# EAGLE design BAAAHS-BRN01-C (EAGLE 9.4.1)

## Sheet 1 of 2
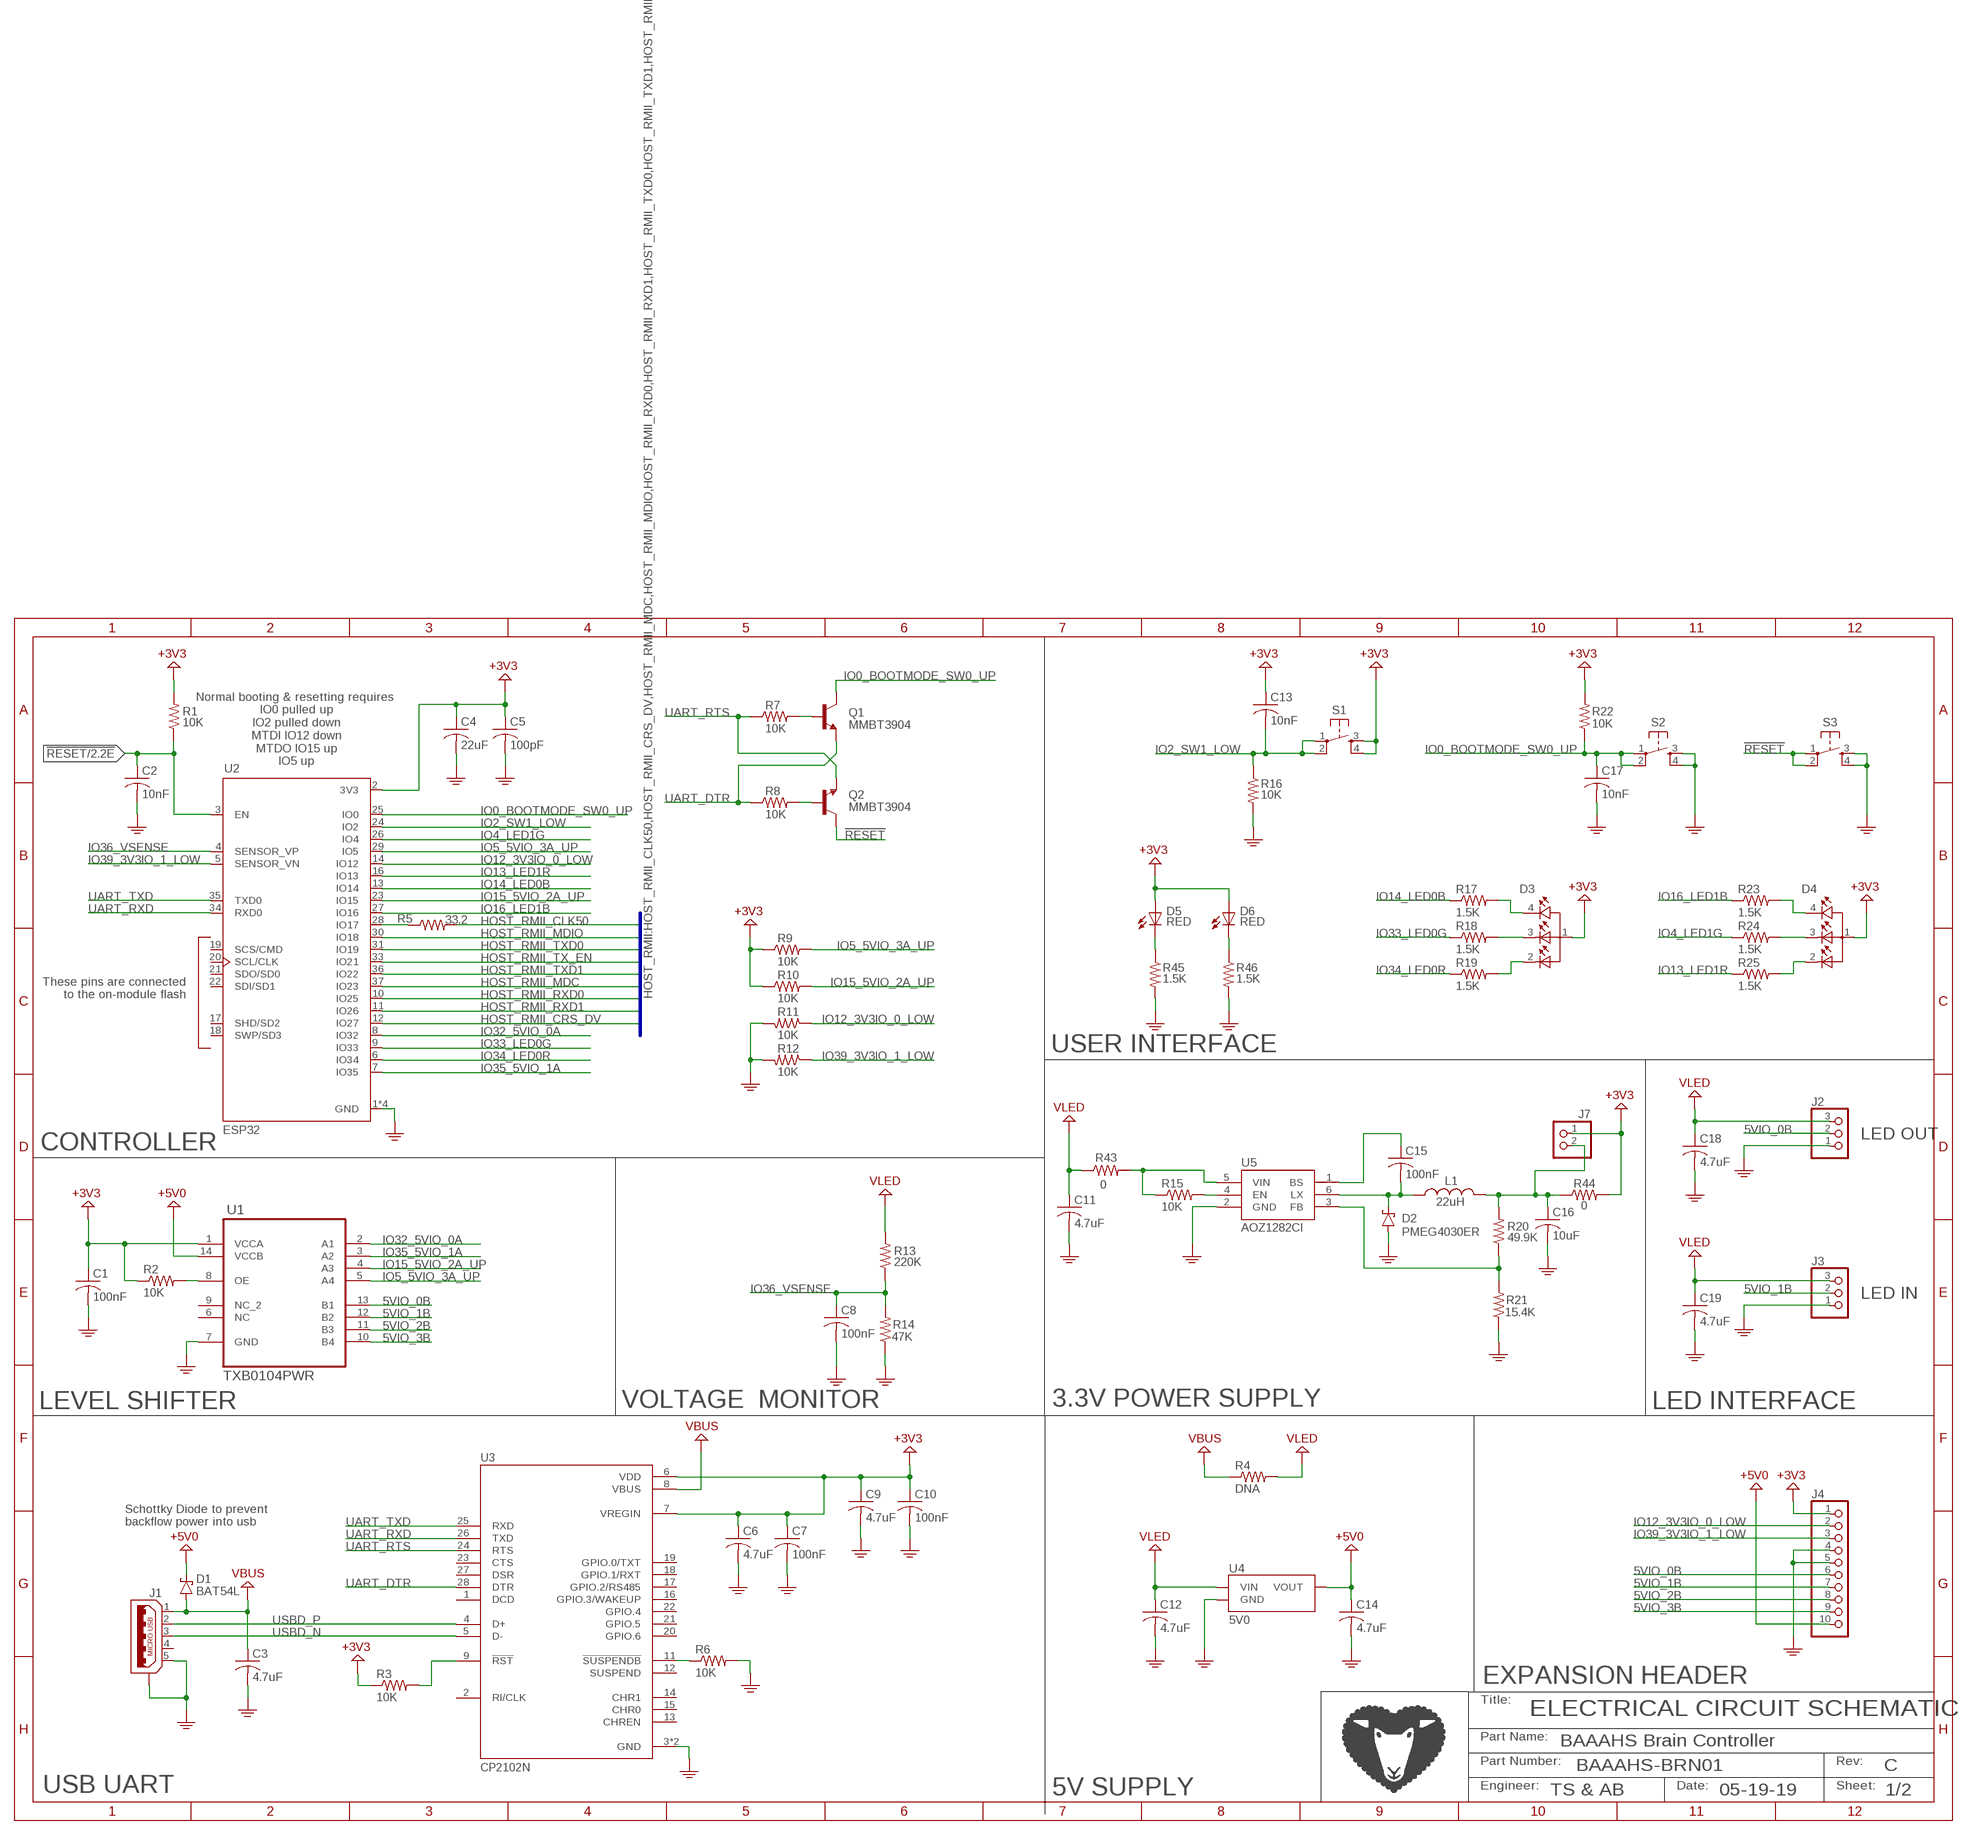
[diagram p0: schematic, sheet 1]
U$1 (SCHEMATIC_TITLEBLOCK_BAAAHS_11X17): DATE: 05-19-19; ENGINEER: TS & AB; PART_NAME: BAAAHS Brain Controller; PART_NUMBER: BAAAHS-BRN01; REV: C

### Parts
C1  100nF  C-100NF_25V_10%-C0402  [C0402]
C2  10nF  C-10NF_16V_10%-C0402  [C0402]
C3  4.7uF  C-4.7UF_10V_10%-C0402  [C0402]
C4  22uF  C-22UF_10V_20%-C0603  [C0603]
C5  100pF  C-100PF_50V_5%-C0402  [C0402]
C6  4.7uF  C-4.7UF_10V_10%-C0402  [C0402]
C7  100nF  C-100NF_25V_10%-C0402  [C0402]
C8  100nF  C-100NF_25V_10%-C0402  [C0402]
C9  4.7uF  C-4.7UF_10V_10%-C0402  [C0402]
C10  100nF  C-100NF_25V_10%-C0402  [C0402]
C11  4.7uF  C-4.7UF_25V_10%-C0603  [C0603]
C12  4.7uF  C-4.7UF_25V_10%-C0603  [C0603]
C13  10nF  C-10NF_16V_10%-C0402  [C0402]
C14  4.7uF  C-4.7UF_10V_10%-C0402  [C0402]
C15  100nF  C-100NF_25V_10%-C0402  [C0402]
C16  10uF  C-10UF_25V_20%-C0603  [C0603]
C17  10nF  C-10NF_16V_10%-C0402  [C0402]
C18  4.7uF  C-4.7UF_25V_10%-C0603  [C0603]
C19  4.7uF  C-4.7UF_25V_10%-C0603  [C0603]
D1  BAT54L  D_SCHOTTKY-SOT23  [SOT23]
D2  PMEG4030ER  D_SCHOTTKY-PMEG4030ER_40V-SOD123  [SOD123]
D3  APTF1616LSEEZGKQBKC  [LEDSC160X160X070-4N]
D4  APTF1616LSEEZGKQBKC  [LEDSC160X160X070-4N]
D5  RED  LED-RED_54MCD-D0603  [D0603]
D6  RED  LED-RED_54MCD-D0603  [D0603]
J1  USB_MICRO-FCI-USB_MICRO_A_RA  [USB_MICRO_A_RA]
J2  PINHD1X3-20AWG  [3WAY_LED_WIRES]
J3  PINHD1X3-20AWG  [3WAY_LED_WIRES]
J4  PINHD1X10-1X10  [1X10]
J7  PINHD1X2-1X02  [1X02]
L1  22uH  L-22UH__290MOHM_700MA-NRG4026  [NRG4026]
Q1  MMBT3904  NPN-MMBT3904_40V-SOT23  [SOT23]
Q2  MMBT3904  NPN-MMBT3904_40V-SOT23  [SOT23]
R1  10K  R-10K_1%-R0402  [R0402]
R2  10K  R-10K_1%-R0402  [R0402]
R3  10K  R-10K_1%-R0402  [R0402]
R4  DNA  R-DNA-R0603  [R0603]
R5  33.2  R-33.2_1%-R0402  [R0402]
R6  10K  R-10K_1%-R0402  [R0402]
R7  10K  R-10K_1%-R0402  [R0402]
R8  10K  R-10K_1%-R0402  [R0402]
R9  10K  R-10K_1%-R0402  [R0402]
R10  10K  R-10K_1%-R0402  [R0402]
R11  10K  R-10K_1%-R0402  [R0402]
R12  10K  R-10K_1%-R0402  [R0402]
R13  220K  R-220K_1%-R0402  [R0402]
R14  47K  R-47K_1%-R0402  [R0402]
R15  10K  R-10K_1%-R0402  [R0402]
R16  10K  R-10K_1%-R0402  [R0402]
R17  1.5K  R-1.5K_1%-R0402  [R0402]
R18  1.5K  R-1.5K_1%-R0402  [R0402]
R19  1.5K  R-1.5K_1%-R0402  [R0402]
R20  49.9K  R-49.9K_1%-R0402  [R0402]
R21  15.4K  R-15.4K_1%-R0402  [R0402]
R22  10K  R-10K_1%-R0402  [R0402]
R23  1.5K  R-1.5K_1%-R0402  [R0402]
R24  1.5K  R-1.5K_1%-R0402  [R0402]
R25  1.5K  R-1.5K_1%-R0402  [R0402]
R43  0  R-0_1%-R0603  [R0603]
R44  0  R-0_1%-R0603  [R0603]
R45  1.5K  R-1.5K_1%-R0402  [R0402]
R46  1.5K  R-1.5K_1%-R0402  [R0402]
S1  SW4-SM6MM  [SM6MM]
S2  SW4-SM6MM  [SM6MM]
S3  SW4-SM6MM  [SM6MM]
U1  TXB0104PWR  [SOP65P640X120-14N]
U2  ESP32  ESP32WROOM32D-MODULE_ESP32WROOM32D  [MODULE_ESP32WROOM32D]
U3  CP2102N  CP2102N-A01-GQFN28  [QFN50P500X500X80_29N]
U4  5V0  TLV76050DBZR-SOT23  [SOT23]
U5  AOZ1282CI  AOZ1282CI-SOT23_6  [SOT23_6]

### Nets
3V3: C1.1 C4.1 C5.1 C6.1 C7.1 C9.1 C10.1 C13.1 D3.1 D4.1 D5.A D6.A J4.1 J7.1 R1.2 R2.1 R3.1 R9.1 R10.1 R22.2 R44.2 S1.3(S) S1.4(S1) U1.1(VCCA) U2.2(3V3) U3.6(VDD) U3.7(VREGIN) ; also sheet 2
5V0 [power]: C14.1 D1.3(C) J4.10 U1.14(VCCB) U4.1(VOUT)
5VIO_0B: J2.2 J4.6 U1.13(B1)
5VIO_1B: J3.2 J4.7 U1.12(B2)
5VIO_2B: J4.8 U1.11(B3)
5VIO_3B: J4.9 U1.10(B4)
!RESET: C2.1 Q2.3(C) R1.1 S3.1(P) S3.2(P1) U2.3(EN) ; also sheet 2
FB: R20.1 R21.2 U5.3(FB)
GND: C1.2 C2.2 C3.2 C4.2 C5.2 C6.2 C7.2 C8.2 C9.2 C10.2 C11.2 C12.2 C14.2 C16.2 C17.2 C18.2 C19.2 D2.A J1.5 J1.S1 J1.S2(S1) J1.S3(S1) J1.S4(S1) J1.S5(S1) J1.S6(S1) J2.1 J3.1 J4.4 J4.5 R6.2 R11.2 R12.2 R14.1 R16.2 R21.1 R45.2 R46.2 S2.3(S) S2.4(S1) S3.3(S) S3.4(S1) U1.7(GND) U2.1(GND) U2.15(GND) U2.38(GND) U2.39(GND) U3.3(GND) U3.29(GND) U4.3(GND) U5.2(GND) ; also sheet 2
HOST_RMII_CLK50: R5.2 ; also sheet 2
HOST_RMII_CRS_DV: U2.12(IO27) ; also sheet 2
HOST_RMII_MDC: U2.37(IO23) ; also sheet 2
HOST_RMII_MDIO: U2.30(IO18) ; also sheet 2
HOST_RMII_RXD0: U2.10(IO25) ; also sheet 2
HOST_RMII_RXD1: U2.11(IO26) ; also sheet 2
HOST_RMII_TX_EN: U2.33(IO21) ; also sheet 2
HOST_RMII_TXD0: U2.31(IO19) ; also sheet 2
HOST_RMII_TXD1: U2.36(IO22) ; also sheet 2
IO0_BOOTMODE_SW0_UP: C17.1 Q1.3(C) R22.1 S2.1(P) S2.2(P1) U2.25(IO0)
IO2_SW1_LOW: C13.2 R16.1 S1.1(P) S1.2(P1) U2.24(IO2)
IO4_LED1G: R24.1 U2.26(IO4)
IO5_5VIO_3A_UP: R9.2 U1.5(A4) U2.29(IO5)
IO12_3V3IO_0_LOW: J4.2 R11.1 U2.14(IO12)
IO13_LED1R: R25.1 U2.16(IO13)
IO14_LED0B: R17.1 U2.13(IO14)
IO15_5VIO_2A_UP: R10.2 U1.4(A3) U2.23(IO15)
IO16_LED1B: R23.1 U2.27(IO16)
IO32_5VIO_0A: U1.2(A1) U2.8(IO32)
IO33_LED0G: R18.1 U2.9(IO33)
IO34_LED0R: R19.1 U2.6(IO34)
IO35_5VIO_1A: U1.3(A2) U2.7(IO35)
IO36_VSENSE: C8.1 R13.1 R14.2 U2.4(SENSOR_VP)
IO39_3V3IO_1_LOW: J4.3 R12.1 U2.5(SENSOR_VN)
N$1: R5.1 U2.28(IO17)
N$3: R15.2 U5.4(EN)
N$4: C15.2 D2.C L1.1 U5.6(LX)
N$5: R3.2 U3.9(!RST)
N$6: R6.1 U3.11(!SUSPENDB)
N$7: Q2.1(B) R8.2
N$8: Q1.1(B) R7.2
N$9: D3.4 R17.2
N$10: D3.3 R18.2
N$11: D3.2 R19.2
N$14: D4.4 R23.2
N$15: D4.3 R24.2
N$16: D4.2 R25.2
N$26: C15.1 U5.1(BS)
N$27: R2.2 U1.8(OE)
N$30 [power]: R15.1 R43.2 U5.5(VIN)
N$31: C16.1 J7.2 L1.2 R20.2 R44.1
N$33: D6.C R46.1
N$36: D5.C R45.1
UART_DTR: Q1.2(E) R8.1 U3.28(DTR)
UART_RTS: Q2.2(E) R7.1 U3.24(RTS)
UART_RXD: U2.34(RXD0) U3.26(TXD)
UART_TXD: U2.35(TXD0) U3.25(RXD)
USBD_N [USB]: J1.3 U3.5(D-)
USBD_P [USB]: J1.2 U3.4(D+)
VBUS: C3.1 D1.1(A) J1.1 R4.1 U3.8(VBUS)
VLED [power]: C11.1 C12.1 C18.1 C19.1 J2.3 J3.3 R4.2 R13.2 R43.1 U4.2(VIN)
Unconnected: J1.4 U1.6(NC) U1.9(NC_2) U2.17(SHD/SD2) U2.18(SWP/SD3) U2.19(SCS/CMD) U2.20(SCL/CLK) U2.21(SDO/SD0) U2.22(SDI/SD1) U3.1(DCD) U3.2(RI/CLK) U3.12(SUSPEND) U3.13(CHREN) U3.14(CHR1) U3.15(CHR0) U3.16(GPIO.3/WAKEUP) U3.17(GPIO.2/RS485) U3.18(GPIO.1/RXT) U3.19(GPIO.0/TXT) U3.20(GPIO.6) U3.21(GPIO.5) U3.22(GPIO.4) U3.23(CTS) U3.27(DSR)

### Buses
HOST_RMII:HOST_RMII_CLK50,HOST_RMII_CRS_DV,HOST_RMII_MDC,HOST_RMII_MDIO,HOST_RMII_RXD0,HOST_RMII_RXD1,HOST_RMII_TXD0,HOST_RMII_TXD1,HOST_RMII_TX_EN

### Notes on the sheet
- Normal booting & resetting requires 
  IO0 pulled up
  IO2 pulled down
  MTDI IO12 down
  MTDO IO15 up
  IO5 up
- These pins are connected
  to the on-module flash
- USER INTERFACE
- LED OUT
- CONTROLLER
- LED IN
- LEVEL SHIFTER | VOLTAGE  MONITOR | 3.3V POWER SUPPLY | LED INTERFACE
- Schottky Diode to prevent
  backflow power into usb
- EXPANSION HEADER
- USB UART | 5V SUPPLY

## Sheet 2 of 2
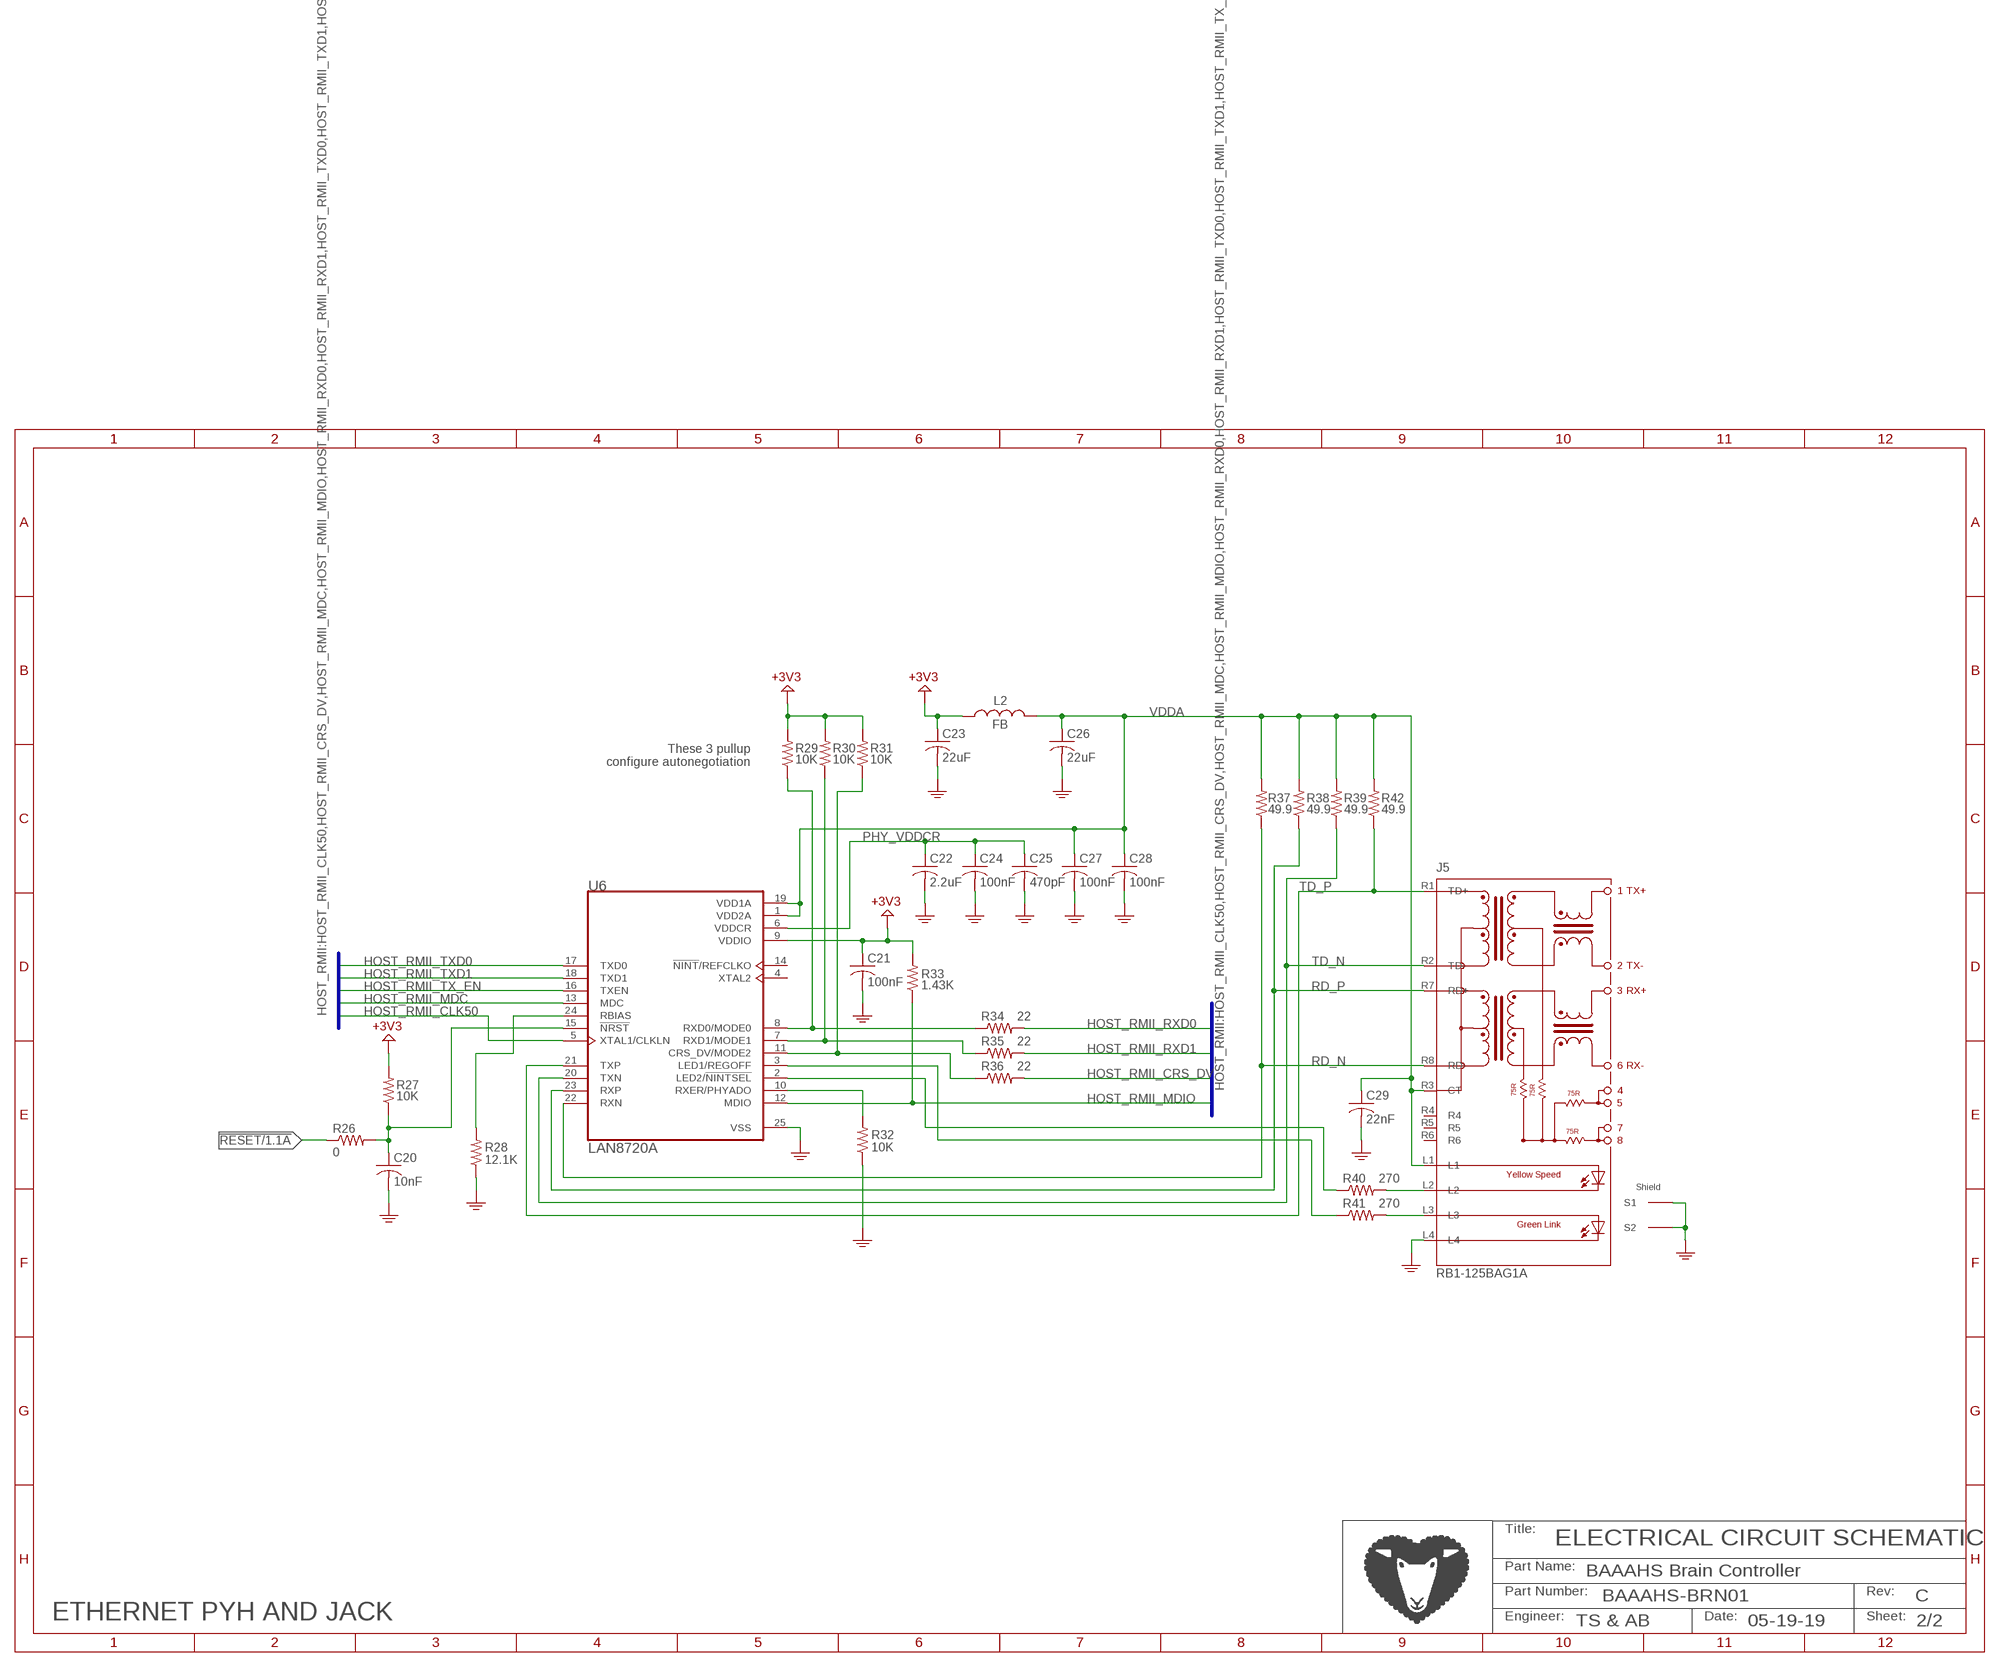
[diagram p1: schematic, sheet 2]
U$2 (SCHEMATIC_TITLEBLOCK_BAAAHS_11X17): DATE: 05-19-19; ENGINEER: TS & AB; PART_NAME: BAAAHS Brain Controller; PART_NUMBER: BAAAHS-BRN01; REV: C

### Parts
C20  10nF  C-10NF_16V_10%-C0402  [C0402]
C21  100nF  C-100NF_25V_10%-C0402  [C0402]
C22  2.2uF  C-2.2UF_16V_10%-C0603  [C0603]
C23  22uF  C-22UF_10V_20%-C0603  [C0603]
C24  100nF  C-100NF_25V_10%-C0402  [C0402]
C25  470pF  C-470PF_50V_10%-C0402  [C0402]
C26  22uF  C-22UF_10V_20%-C0603  [C0603]
C27  100nF  C-100NF_25V_10%-C0402  [C0402]
C28  100nF  C-100NF_25V_10%-C0402  [C0402]
C29  22nF  C-22NF_16V_10%-C0402  [C0402]
J5  RB1-125BAG1A  [WIZNET_RB1-125BAG1A]
L2  FB  FB-600OHM_0.2A-L0603  [L0603]
R26  0  R-0_1%-R0402  [R0402]
R27  10K  R-10K_1%-R0402  [R0402]
R28  12.1K  R-12.1K_1%-R0402  [R0402]
R29  10K  R-10K_1%-R0402  [R0402]
R30  10K  R-10K_1%-R0402  [R0402]
R31  10K  R-10K_1%-R0402  [R0402]
R32  10K  R-10K_1%-R0402  [R0402]
R33  1.43K  R-1.43K_1%-R0402  [R0402]
R34  22  R-22_1%-R0402  [R0402]
R35  22  R-22_1%-R0402  [R0402]
R36  22  R-22_1%-R0402  [R0402]
R37  49.9  R-49.9_1%-R0402  [R0402]
R38  49.9  R-49.9_1%-R0402  [R0402]
R39  49.9  R-49.9_1%-R0402  [R0402]
R40  270  R-270_1%-R0402  [R0402]
R41  270  R-270_1%-R0402  [R0402]
R42  49.9  R-49.9_1%-R0402  [R0402]
U6  LAN8720A  LAN8720A-CP  [QFN50P400X400X100-25N]

### Nets
3V3: C21.1 C23.1 L2.1 R27.2 R29.2 R30.2 R31.2 R33.2 U6.9(VDDIO) ; also sheet 1
!RESET: R26.1 ; also sheet 1
GND: C20.2 C21.2 C22.2 C23.2 C24.2 C25.2 C26.2 C27.2 C28.2 C29.2 J5.L4 J5.S1 J5.S2 R28.1 R32.1 U6.25(VSS) ; also sheet 1
HOST_RMII_CLK50: U6.5(XTAL1/CLKLN) ; also sheet 1
HOST_RMII_CRS_DV: R36.2 ; also sheet 1
HOST_RMII_MDC: U6.13(MDC) ; also sheet 1
HOST_RMII_MDIO: R33.1 U6.12(MDIO) ; also sheet 1
HOST_RMII_RXD0: R34.2 ; also sheet 1
HOST_RMII_RXD1: R35.2 ; also sheet 1
HOST_RMII_TX_EN: U6.16(TXEN) ; also sheet 1
HOST_RMII_TXD0: U6.17(TXD0) ; also sheet 1
HOST_RMII_TXD1: U6.18(TXD1) ; also sheet 1
N$2: J5.L3 R41.2
N$18: R31.1 R36.1 U6.11(CRS_DV/MODE2)
N$20: R30.1 R35.1 U6.7(RXD1/MODE1)
N$21: R29.1 R34.1 U6.8(RXD0/MODE0)
N$22: R28.2 U6.24(RBIAS)
N$23: R41.1 U6.3(LED1/REGOFF)
N$24: R40.1 U6.2(LED2/!NINTSEL!)
N$25: J5.L2 R40.2
N$28: C20.1 R26.2 R27.1 U6.15(!NRST)
N$29: R32.2 U6.10(RXER/PHYADO)
PHY_VDDCR: C22.1 C24.1 C25.1 U6.6(VDDCR)
RD_N [Ethernet]: J5.R8(RD-) R37.1 U6.22(RXN)
RD_P [Ethernet]: J5.R7(RD+) R38.1 U6.23(RXP)
TD_N [Ethernet]: J5.R2(TD-) R39.1 U6.20(TXN)
TD_P [Ethernet]: J5.R1(TD+) R42.1 U6.21(TXP)
VDDA: C26.1 C27.1 C28.1 C29.1 J5.L1 J5.R3(CT) L2.2 R37.2 R38.2 R39.2 R42.2 U6.1(VDD2A) U6.19(VDD1A)
Unconnected: J5.R4 J5.R5 J5.R6 U6.4(XTAL2) U6.14(!NINT!/REFCLKO)

### Buses
HOST_RMII:HOST_RMII_CLK50,HOST_RMII_CRS_DV,HOST_RMII_MDC,HOST_RMII_MDIO,HOST_RMII_RXD0,HOST_RMII_RXD1,HOST_RMII_TXD0,HOST_RMII_TXD1,HOST_RMII_TX_EN

### Notes on the sheet
- These 3 pullup
  configure autonegotiation
- ETHERNET PYH AND JACK

## Library data of the parts
C1 C7 C8 C10 C15 C21 C24 C27 C28 = capacitors:C; CAPACITANCE: 100nF; CAPACITANCE_TOLERANCE: 10%; CATEGORY: Capacitor; DESCRIPTION: CAP CER 100NF 25V X7R 0402; DIELECTRIC: X7R; FOOTPRINT: C0402; HEIGHT: 0.55mm; LENGTH: 1.0mm; OPL: YES; PACKAGE: C0402; PRI_MFG: Samsung; PRI_MFG_PN: CL05B104KA5NNNC; THICKNESS: 0.55mm; TOLERANCE: +/-10%; VOLTAGE: 25V; WIDTH: 0.5mm
C2 C13 C17 C20 = capacitors:C; CAPACITANCE: 10nF; CAPACITANCE_TOLERANCE: 10%; CATEGORY: Capacitor; DESCRIPTION: CAP CER 10NF 16V X7R 0402; DIELECTRIC: X7R; FOOTPRINT: C0402; HEIGHT: 0.55mm; LENGTH: 1.0mm; OPL: YES; PACKAGE: C0402; PRI_MFG: Samsung; PRI_MFG_PN: CL05B103KO5NNNC; THICKNESS: 0.55mm; TOLERANCE: +/-10%; VOLTAGE: 16V; WIDTH: 0.5mm
C3 C6 C9 C14 = capacitors:C; CAPACITANCE: 4.7uF; CAPACITANCE_TOLERANCE: 10%; CATEGORY: Capacitor; DESCRIPTION: CAP CER 4.7UF 10V X5R 0402; DIELECTRIC: X5R; FOOTPRINT: C0402; HEIGHT: 0.55mm; LENGTH: 1.0mm; OPL: YES; PACKAGE: C0402; PRI_MFG: Samsung; PRI_MFG_PN: CL05A475KP5NRNC; THICKNESS: 0.55mm; TOLERANCE: +/-10%; VOLTAGE: 10V; WIDTH: 0.5mm
C4 C23 C26 = capacitors:C; CAPACITANCE: 22uF; CAPACITANCE_TOLERANCE: 20%; CATEGORY: Capacitor; DESCRIPTION: CAP CER 22UF 10V X5R 0603; DIELECTRIC: X5R; FOOTPRINT: C0603; HEIGHT: 1.0mm; LENGTH: 1.6mm; OPL: YES; PACKAGE: C0603; PRI_MFG: Samsung; PRI_MFG_PN: CL10A226MP8NUNE; THICKNESS: 1.0mm; TOLERANCE: +/-20%; VOLTAGE: 10V; WIDTH: 0.8mm
C5 = capacitors:C; CAPACITANCE: 100pF; CAPACITANCE_TOLERANCE: 5%; CATEGORY: Capacitor; DESCRIPTION: CAP CER 100PF 50V C0G 0402; DIELECTRIC: C0G; FOOTPRINT: C0402; HEIGHT: 0.55mm; LENGTH: 1.0mm; OPL: YES; PACKAGE: C0402; PRI_MFG: Samsung; PRI_MFG_PN: CL05C101JB5NNNC; THICKNESS: 0.55mm; TOLERANCE: +/-5%; VOLTAGE: 50V; WIDTH: 0.5mm
C11 C12 C18 C19 = capacitors:C; CAPACITANCE: 4.7uF; CAPACITANCE_TOLERANCE: 10%; CATEGORY: Capacitor; DESCRIPTION: CAP CER 4.7UF 25V X5R 0603; DIELECTRIC: X5R; FOOTPRINT: C0603; HEIGHT: 1.0mm; LENGTH: 1.6mm; OPL: YES; PACKAGE: C0603; PRI_MFG: Samsung; PRI_MFG_PN: CL10A475KA8NQNC; THICKNESS: 1.0mm; TOLERANCE: +/-10%; VOLTAGE: 25V; WIDTH: 0.8mm
C16 = capacitors:C; CAPACITANCE: 10uF; CAPACITANCE_TOLERANCE: 20%; CATEGORY: Capacitor; DESCRIPTION: CAP CER 10UF 25V X5R 0603; DIELECTRIC: X5R; FOOTPRINT: C0603; HEIGHT: 1.0mm; LENGTH: 1.6mm; OPL: YES; PACKAGE: C0603; PRI_MFG: Samsung; PRI_MFG_PN: CL10A106MA8NRNC; THICKNESS: 1.0mm; TOLERANCE: +/-20%; VOLTAGE: 25V; WIDTH: 0.8mm
C22 = capacitors:C; CAPACITANCE: 2.2uF; CAPACITANCE_TOLERANCE: 10%; CATEGORY: Capacitor; DESCRIPTION: CAP CER 2.2UF 16V X5R 0603; DIELECTRIC: X5R; FOOTPRINT: C0603; HEIGHT: 1.0mm; LENGTH: 1.6mm; OPL: YES; PACKAGE: C0603; PRI_MFG: Samsung; PRI_MFG_PN: CL10A225KO8NNNC; THICKNESS: 1.0mm; TOLERANCE: +/-10%; VOLTAGE: 16V; WIDTH: 0.8mm
C25 = capacitors:C; CAPACITANCE: 470pF; CAPACITANCE_TOLERANCE: 10%; CATEGORY: Capacitor; DESCRIPTION: CAP CER 470PF 50V X7R 0402; DIELECTRIC: X7R; FOOTPRINT: C0402; HEIGHT: 0.55mm; LENGTH: 1.0mm; OPL: YES; PACKAGE: C0402; PRI_MFG: Samsung; PRI_MFG_PN: CL05B471KB5NNNC; THICKNESS: 0.55mm; TOLERANCE: +/-10%; VOLTAGE: 50V; WIDTH: 0.5mm
C29 = capacitors:C; CAPACITANCE: 22nF; CAPACITANCE_TOLERANCE: 10%; CATEGORY: Capacitor; DESCRIPTION: CAP CER 22NF 16V X7R 0402; DIELECTRIC: X7R; FOOTPRINT: C0402; HEIGHT: 0.55mm; LENGTH: 1.0mm; OPL: YES; PACKAGE: C0402; PRI_MFG: Samsung; PRI_MFG_PN: CL05B223KO5NNNC; THICKNESS: 0.55mm; TOLERANCE: +/-10%; VOLTAGE: 16V; WIDTH: 0.5mm
D1 = diodes:D_SCHOTTKY; CAPACITANCE: 10pF; CATEGORY: Diode & Rectifier; CURRENT: 200mA; DESCRIPTION: DIODE SCHOTTKY 30V 200MA SOT23-3; DIGIKEY_PN: BAT54LT1GOSCT-ND; FORWARD_VOLTAGE: 800mV; HEIGHT: 1.0mm; LAST_SYNC: 2017/01/06; OPL: YES; OPL_PN: BAT54LT1G; PACKAGE: SOT23; PRICE_1K: 0.010; PRI_MFG: Fairchild Semiconductor; PRI_MFG_PN: BAT54LT1G; REVERSE_VOLTAGE: 30V
D2 = diodes:D_SCHOTTKY; CATEGORY: Diode & Rectifier; CURRENT: 3A; DESCRIPTION: DIODE SCHOTTKY 40V 3A SOD123W; DIGIKEY_PN: 1727-5313-1-ND; FORWARD_VOLTAGE: 460mV; HEIGHT: 1.1mm; IF: 3A; LENGTH: 3.3mm; OPL: YES; PACKAGE: SOD123; PRI_MFG: Nexperia USA Inc.; PRI_MFG_PN: PMEG4030ER,115; REVERSE_VOLTAGE: 40V; WIDTH: 1.9mm
D3 D4 = leds:APTF1616LSEEZGKQBKC: HELI Colour; 1.6X1.6MM LOW CURRENT RGB SMD LED; DESCRIPTION: LED RGB CLEAR 4SMD; DIGIKEY_PN: 754-1972-2-ND; PACKAGE: 0606; PRI_MFG: Kingbright; PRI_MFG_PN: APTF1616LSEEZGKQBKC
D5 D6 = leds:LED; ANGLE: 130deg; CATEGORY: Optoelectronics; COLOR: Red; CURRENT: 20mA; DESCRIPTION: LED RED CLEAR 0603 SMD; DIGIKEY_PN: 160-1447-1-ND; FORWARD_VOLTAGE: 2V; HEIGHT: 0.55mm; LAST_SYNC: 2016/10/21; LENGTH: 1.6mm; LUMINOUS_INTENSITY: 54mcd; OPL: YES; OPL_PN: ORH-R36G; PACKAGE: D0603; PRICE_1K: 0.027; PRI_MFG: Lite-On; PRI_MFG_PN: LTST-C191KRKT; VIEWING_ANGLE: 130; WAVELENGTH: 639nm; WIDTH: 0.8mm
J1 = connectors:USB_MICRO; CATEGORY: Header, Socket & Connector; DESCRIPTION: CONN RCPT USB2.0 MICRO B SMD R/A; DIGIKEY_PN: 609-4616-1-ND; OPL: YES; PACKAGE: USB_MICRO_A_RA; PRICE_1K: 0.20843; PRI_MFG: FCI; PRI_MFG_PN: 10118193-0001LF
J2 J3 = connectors:PINHD1X3: PIN HEADER
J4 = connectors:PINHD1X10
J5 = connectors:RB1-125BAG1A: Wiznet RB1-125BAG1A RJ45 1x1 Tab Down Through Hole; DESCRIPTION: CONN MAGJACK 1PORT 100 BASE-T; DIGIKEY_PN: 1278-1011-ND; PRI_MFG: WIZnet; PRI_MFG_PN: RB1-125BAG1A
J7 = connectors:PINHD1X2
L1 = inductors:L: General purpose power inductors; CATEGORY: Inductor, Coil & Filter; DESCRIPTION: FIXED IND 22UH 700MA 290 MOHM; DIGIKEY_PN: 732-5510-1-ND; HEIGHT: 1.8mm; INDUCTANCE: 22uH; OPL: YES; OPL_MFG: Sunlord; OPL_PN: SWPA4020S220MT; PRI_MFG: Wurth Electronics Inc.; PRI_MFG_PN: 74404042220; WIDTH: 4.0mm
L2 = inductors:FB: General purpose ferrite bead filter elements; CATEGORY: Inductor, Coil & Filter; CURRENT: 200mA; DCR: 600mOhm; DESCRIPTION: FERRITE BEAD 600 OHM 0603 1LN; DIGIKEY_PN: 490-5227-1-ND; HEIGHT: 0.95mm; OPL: YES; PACKAGE: L0603; PRICE_1K: 0.02640; PRI_MFG: Murata; PRI_MFG_PN: BLM18RK601SN1D; R_100MHZ: 600Ohm
Q1 Q2 = transistors:NPN: General Purpose Bipolar NPN Transistors; CATEGORY: Transistor, Mosfet & SCR; CURRENT: 200mA; DESCRIPTION: TRANS NPN 40V 0.2A SOT23; DIGIKEY_PN: MMBT3904LT3GOSCT-ND; HEIGHT: 1.0; LAST_SYNC: 2017/02/09; OPL: YES; PACKAGE: SOT23; PRICE_1K: 0.150; PRI_MFG: ON Semiconductor; PRI_MFG_PN: MMBT3904LT3G; VOLTAGE: 40V; VOLTAGE_RATING_DC: 40V; VSAT: 0.3V
R1-R3 R6-R12 R15 R16 R22 R27 R29-R32 = resistors:R; CATEGORY: Resistor & Potentiometer; DESCRIPTION: RES SMD 10K 1% 1/16W 0402; FOOTPRINT: R0402; HEIGHT: 0.4mm; LENGTH: 1.0mm; OPL: YES; PACKAGE: R0402; POWER: 1/16W; PRICE_1K: 0.01; PRI_MFG: Yageo; PRI_MFG_PN: RC0402FR-0710KL; P_MAX: 1/16W; RESISTANCE: 10Kohm; THICKNESS: 0.4mm; TOLERANCE: 1%; WIDTH: 0.5mm
R4 = resistors:R; CATEGORY: Resistor & Potentiometer; DIGIKEY_PN: N/A; HEIGHT: 0.45mm; LENGTH: 1.6mm; PACKAGE: R0603; POWER: 1/16W; PRI_MFG: N/A; PRI_MFG_PN: N/A; TOLERANCE: N/A; WIDTH: 0.8mm
R5 = resistors:R; CATEGORY: Resistor & Potentiometer; DESCRIPTION: RES SMD 33.2 1% 1/16W 0402; FOOTPRINT: R0402; HEIGHT: 0.4mm; LENGTH: 1.0mm; OPL: YES; PACKAGE: R0402; POWER: 1/16W; PRICE_1K: 0.01; PRI_MFG: Yageo; PRI_MFG_PN: RC0402FR-0733R2L; P_MAX: 1/16W; RESISTANCE: 33.2ohm; THICKNESS: 0.4mm; TOLERANCE: 1%; WIDTH: 0.5mm
R13 = resistors:R; CATEGORY: Resistor & Potentiometer; DESCRIPTION: RES SMD 220K 1% 1/16W 0402; FOOTPRINT: R0402; HEIGHT: 0.4mm; LENGTH: 1.0mm; OPL: YES; PACKAGE: R0402; POWER: 1/16W; PRICE_1K: 0.01; PRI_MFG: Yageo; PRI_MFG_PN: RC0402FR-07220KL; P_MAX: 1/16W; RESISTANCE: 220Kohm; THICKNESS: 0.4mm; TOLERANCE: 1%; WIDTH: 0.5mm
R14 = resistors:R; CATEGORY: Resistor & Potentiometer; DESCRIPTION: RES SMD 47K 1% 1/16W 0402; FOOTPRINT: R0402; HEIGHT: 0.4mm; LENGTH: 1.0mm; OPL: YES; PACKAGE: R0402; POWER: 1/16W; PRICE_1K: 0.01; PRI_MFG: Yageo; PRI_MFG_PN: RC0402FR-0747KL; P_MAX: 1/16W; RESISTANCE: 47Kohm; THICKNESS: 0.4mm; TOLERANCE: 1%; WIDTH: 0.5mm
R17-R19 R23-R25 R45 R46 = resistors:R; CATEGORY: Resistor & Potentiometer; DESCRIPTION: RES SMD 1.5K 1% 1/16W 0402; FOOTPRINT: R0402; HEIGHT: 0.4mm; LENGTH: 1.0mm; OPL: YES; PACKAGE: R0402; POWER: 1/16W; PRICE_1K: 0.01; PRI_MFG: Yageo; PRI_MFG_PN: RC0402FR-071K5L; P_MAX: 1/16W; RESISTANCE: 1.5Kohm; THICKNESS: 0.4mm; TOLERANCE: 1%; WIDTH: 0.5mm
R20 = resistors:R; CATEGORY: Resistor & Potentiometer; DESCRIPTION: RES SMD 49.9K 1% 1/16W 0402; FOOTPRINT: R0402; HEIGHT: 0.4mm; LENGTH: 1.0mm; OPL: YES; PACKAGE: R0402; POWER: 1/16W; PRICE_1K: 0.01; PRI_MFG: Yageo; PRI_MFG_PN: RC0402FR-0749K9L; P_MAX: 1/16W; RESISTANCE: 49.9Kohm; THICKNESS: 0.4mm; TOLERANCE: 1%; WIDTH: 0.5mm
R21 = resistors:R; CATEGORY: Resistor & Potentiometer; DESCRIPTION: RES SMD 15.4K 1% 1/16W 0402; FOOTPRINT: R0402; HEIGHT: 0.4mm; LENGTH: 1.0mm; OPL: YES; PACKAGE: R0402; POWER: 1/16W; PRICE_1K: 0.01; PRI_MFG: Yageo; PRI_MFG_PN: RC0402FR-0715K4L; P_MAX: 1/16W; RESISTANCE: 15.4Kohm; THICKNESS: 0.4mm; TOLERANCE: 1%; WIDTH: 0.5mm
R26 = resistors:R; CATEGORY: Resistor & Potentiometer; DESCRIPTION: RES SMD 0 1% 1/16W 0402; FOOTPRINT: R0402; HEIGHT: 0.4mm; LENGTH: 1.0mm; OPL: YES; PACKAGE: R0402; POWER: 1/16W; PRICE_1K: 0.01; PRI_MFG: Yageo; PRI_MFG_PN: RC0402FR-070RL; P_MAX: 1/16W; RESISTANCE: 0ohm; THICKNESS: 0.4mm; TOLERANCE: 1%; WIDTH: 0.5mm
R28 = resistors:R; CATEGORY: Resistor & Potentiometer; DESCRIPTION: RES SMD 12.1K 1% 1/16W 0402; FOOTPRINT: R0402; HEIGHT: 0.4mm; LENGTH: 1.0mm; OPL: YES; PACKAGE: R0402; POWER: 1/16W; PRICE_1K: 0.01; PRI_MFG: Yageo; PRI_MFG_PN: RC0402FR-0712K1L; P_MAX: 1/16W; RESISTANCE: 12.1Kohm; THICKNESS: 0.4mm; TOLERANCE: 1%; WIDTH: 0.5mm
R33 = resistors:R; CATEGORY: Resistor & Potentiometer; DESCRIPTION: RES SMD 1.43K 1% 1/16W 0402; FOOTPRINT: R0402; HEIGHT: 0.4mm; LENGTH: 1.0mm; OPL: YES; PACKAGE: R0402; POWER: 1/16W; PRICE_1K: 0.01; PRI_MFG: Yageo; PRI_MFG_PN: RC0402FR-071K43L; P_MAX: 1/16W; RESISTANCE: 1.43Kohm; THICKNESS: 0.4mm; TOLERANCE: 1%; WIDTH: 0.5mm
R34-R36 = resistors:R; CATEGORY: Resistor & Potentiometer; DESCRIPTION: RES SMD 22 1% 1/16W 0402; FOOTPRINT: R0402; HEIGHT: 0.4mm; LENGTH: 1.0mm; OPL: YES; PACKAGE: R0402; POWER: 1/16W; PRICE_1K: 0.01; PRI_MFG: Yageo; PRI_MFG_PN: RC0402FR-0722RL; P_MAX: 1/16W; RESISTANCE: 22ohm; THICKNESS: 0.4mm; TOLERANCE: 1%; WIDTH: 0.5mm
R37-R39 R42 = resistors:R; CATEGORY: Resistor & Potentiometer; DESCRIPTION: RES SMD 49.9 1% 1/16W 0402; FOOTPRINT: R0402; HEIGHT: 0.4mm; LENGTH: 1.0mm; OPL: YES; PACKAGE: R0402; POWER: 1/16W; PRICE_1K: 0.01; PRI_MFG: Yageo; PRI_MFG_PN: RC0402FR-0749R9L; P_MAX: 1/16W; RESISTANCE: 49.9ohm; THICKNESS: 0.4mm; TOLERANCE: 1%; WIDTH: 0.5mm
R40 R41 = resistors:R; CATEGORY: Resistor & Potentiometer; DESCRIPTION: RES SMD 270 1% 1/16W 0402; FOOTPRINT: R0402; HEIGHT: 0.4mm; LENGTH: 1.0mm; OPL: YES; PACKAGE: R0402; POWER: 1/16W; PRICE_1K: 0.01; PRI_MFG: Yageo; PRI_MFG_PN: RC0402FR-07270RL; P_MAX: 1/16W; RESISTANCE: 270ohm; THICKNESS: 0.4mm; TOLERANCE: 1%; WIDTH: 0.5mm
R43 R44 = resistors:R; CATEGORY: Resistor & Potentiometer; DESCRIPTION: RES SMD 0 1% 1/10W 0603; FOOTPRINT: R0603; HEIGHT: 0.55mm; LENGTH: 1.6mm; OPL: YES; PACKAGE: R0603; POWER: 1/10W; PRICE_1K: 0.01; PRI_MFG: Yageo; PRI_MFG_PN: RC0603FR-070RL; P_MAX: 1/10W; RESISTANCE: 0ohm; THICKNESS: 0.55mm; TOLERANCE: 1%; WIDTH: 0.8mm
S1-S3 = switches:SW4: Momentary Pushbutton Tact Switch - 4 Terminal; CATEGORY: Switches & Relays; CONTACTS_TYPE: SPST; CONTACT_PLATING: Silver; CURRENT: 50mA; DESCRIPTION: SWITCH TACTILE SPST-NO 0.05A 24V; DIGIKEY_PN: 450-1759-1-ND; HEIGHT: 5.0; LAST_SYNC: 2016/10/21; OPL: YES; OPL_PN: K2-1102SP-C4SC-04; PACKAGE: SM-6MM; PRICE_1K: 0.108; PRI_MFG: TE Connectivity; PRI_MFG_PN: 4-1437565-2
U1 = converter:TXB0104PWR: 4-BIT BIDIRECTIONAL VOLTAGE-LEVEL TRANSLATOR; DESCRIPTION: IC TRNSLTR BIDIRECTIONAL 14TSSOP; DIGIKEY_PN: 296-21929-2-ND; PACKAGE: TSSOP14; PRI_MFG: Texas Instruments; PRI_MFG_PN: TXB0104PWR
U2 = modules:ESP32WROOM32D: IC: SoC; GPIO, I2C, I2S, IR, SD, SDIO, SPI, UART; 2.7÷3.6VDC; 20dBm; CATEGORY: Modules; DESCRIPTION: ESP32 BLE WIFI MODULE; DIGIKEY_PN: 1904-1023-1-ND; FOOTPRINT: MODULE_ESP32WROOM32D; HEIGHT: 3.1mm; OPL: NO; PACKAGE: MODULE_ESP32WROOM32D; PRICE_1K: 3.80; PRI_MFG: Espressif Systems; PRI_MFG_PN: ESP32-WROOM-32D; SUPPLY_VOLTAGE_DC: 3.3V
U3 = interface:CP2102N-A01-GQFN28: Ic Bridge Usb To Uart 28qfn; DESCRIPTION: IC BRIDGE USB TO UART 28QFN; DIGIKEY_PN: 336-4738-1-ND; PACKAGE: QFN28; PRI_MFG: Silicon Labs; PRI_MFG_PN: CP2102N-A01-GQFN28
U4 = regulators:TLV76050DBZR; DESCRIPTION: IC REG LINEAR 5V 100MA SOT23-3; DIGIKEY_PN: 296-48333-1-ND; PRI_MFG: Texas Instruments; PRI_MFG_PN: TLV76050DBZR
U5 = regulators:AOZ1282CI; CATEGORY: ICs; CURRENT: 1.2A; DESCRIPTION: IC REG BUCK ADJ 1.2A SOT23-6; DIGIKEY_PN: 785-1613-1-ND; MAX_CURRENT: 1.2A; OPL: YES; PACKAGE: SOT23_6; PRI_MFG: Alpha & Omega Semiconductor Inc.; PRI_MFG_PN: AOZ1282CI; SWITCHING_FREQUENCY: 450kHz
U6 = interface:LAN8720A-CP: LAN8720A Series 3.3 V RMII 10/100 Ethernet Transceiver Surface Mount - QFN-24; DESCRIPTION: IC TXRX ETHERNET 24QFN; DIGIKEY_PN: 638-1080-ND; PACKAGE: QFN24; PRI_MFG: Microchip; PRI_MFG_PN: LAN8720A-CP; VAL: LAN8720A

## Net classes
0 default: width 0.203 mm, clearance 0.203 mm
1 power: width 0.406 mm, clearance 0.203 mm
2 USB: width 0.279 mm, clearance 0.203 mm
3 Ethernet: width 0.229 mm, clearance 0.203 mm

## Board
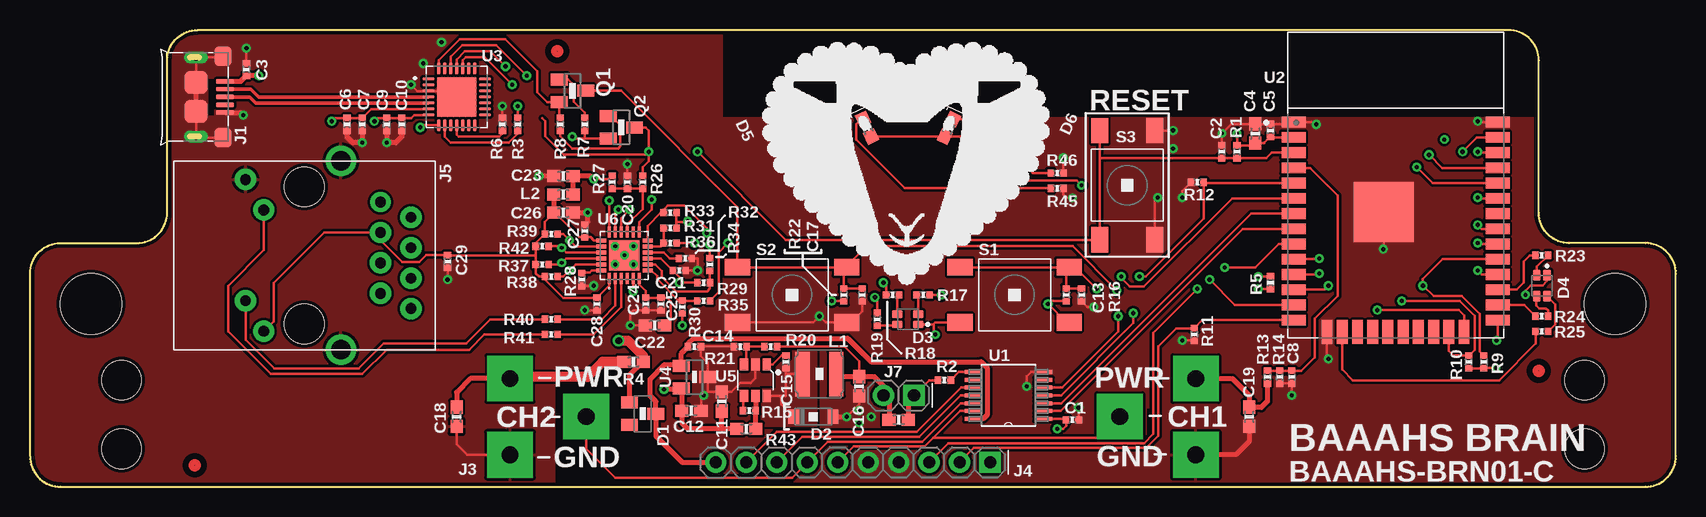
[diagram p2: board, top side]
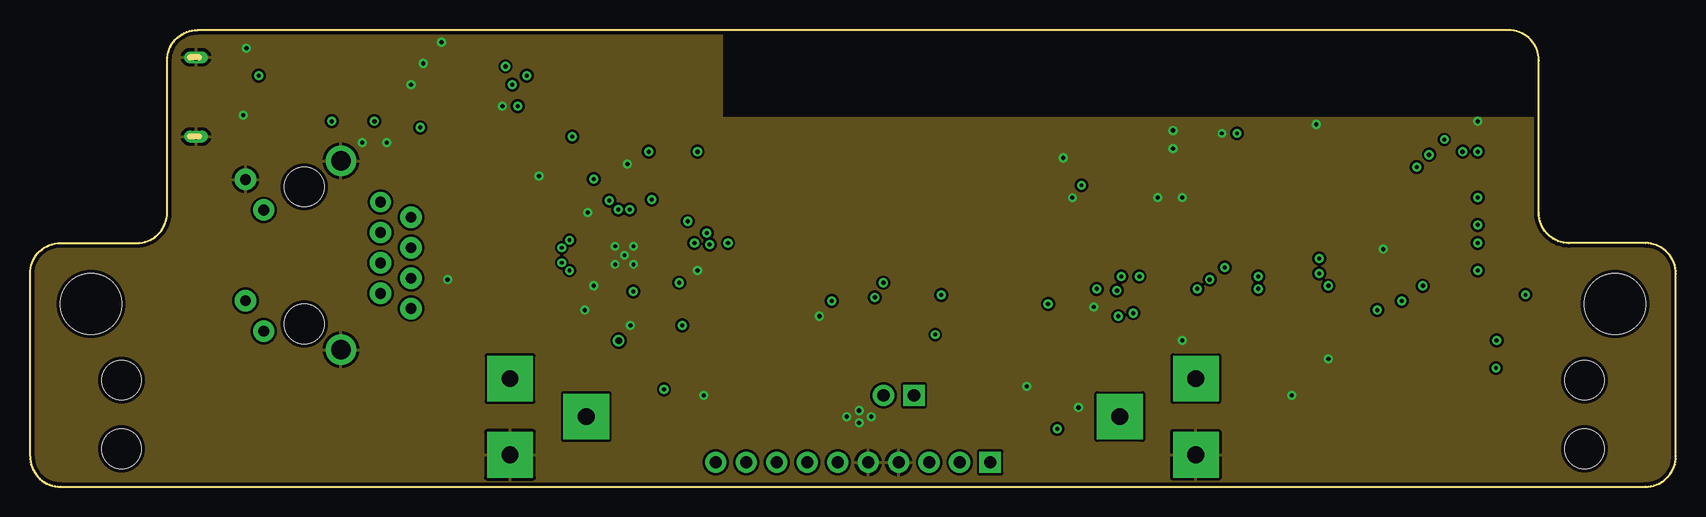
[diagram p3: board, inner layer Route2]
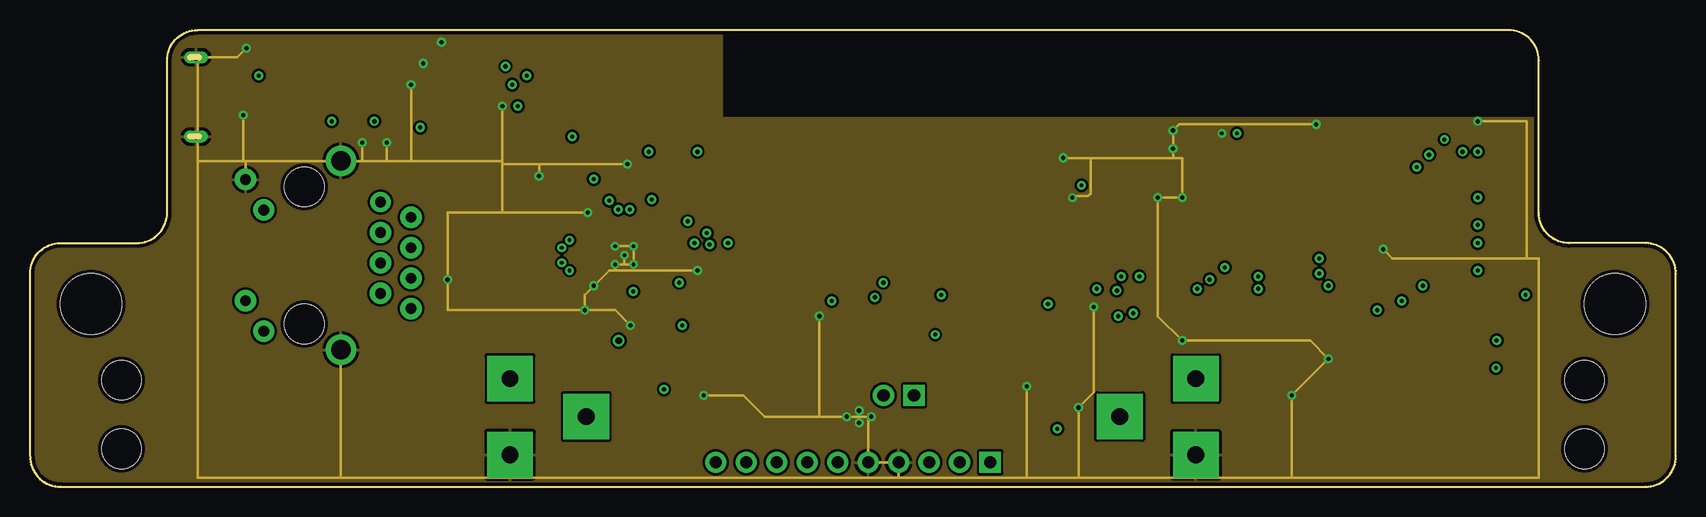
[diagram p4: board, inner layer Route15]
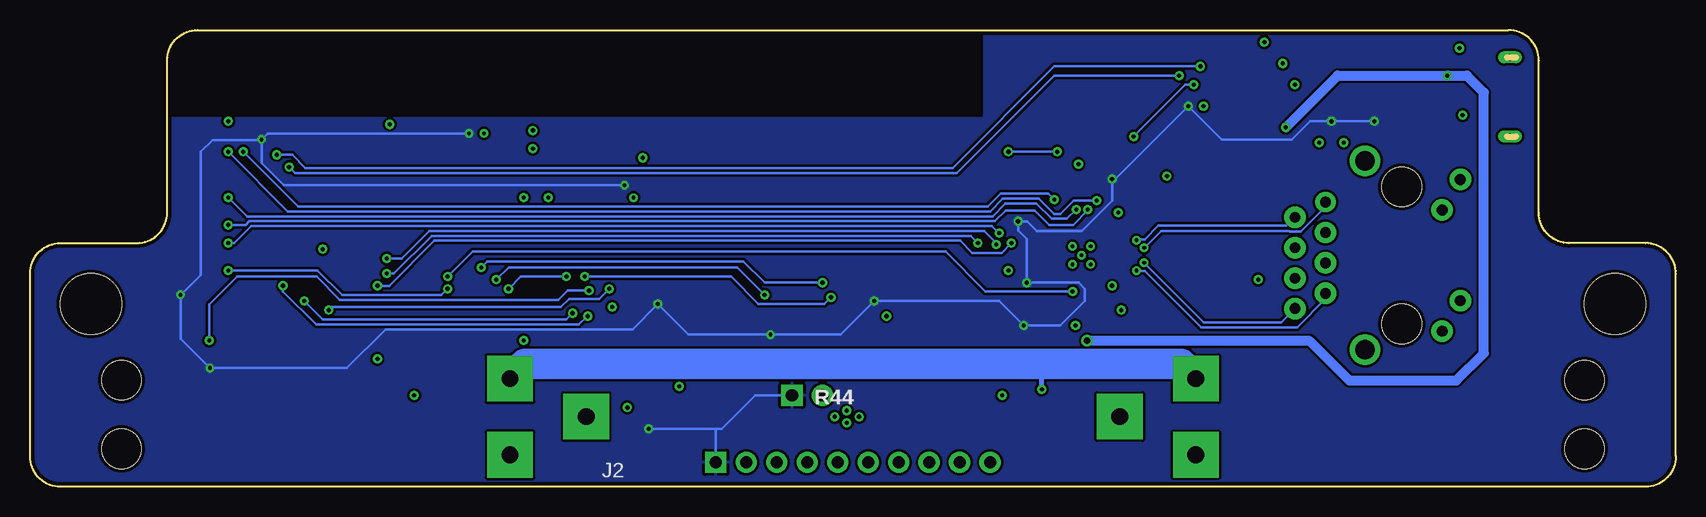
[diagram p5: board, bottom side, seen from below]

Size 137.16 x 38.1 mm. Coordinates in mm from the lower left corner, seen from the top.
Outline: 0,2.54 0,17.78 arc-90 2.54,20.32 8.89,20.32 arc90 11.43,22.86 11.43,35.56 arc-90 13.97,38.1 123.19,38.1 arc-90 125.73,35.56 125.73,22.86 arc90 128.27,20.32 134.62,20.32 arc-90 137.16,17.78 137.16,2.54 arc-90 134.62,0 2.54,0 arc-90 0,2.54
Copper layers (1+2*15+16): Top 0.035mm / dielectric 0.12mm / Route2 0.035mm / dielectric 1.2mm / Route15 0.035mm / dielectric 0.12mm / Bottom 0.035mm
Design rules "default *": minimum track width 8mil, minimum drill 0.3mm, track to track 8mil, track to pad 8mil, pad to pad 8mil, via to via 8mil, smd to smd 8mil, copper to edge 0.3mm, drill to drill 18mil, minimum pad ring 6mil, minimum via ring 8mil, stop-mask expansion 4mil, vias tented up to drill 15mil, thermal gap 10mil
Holes 5.08 mm at 5.08,15.24 132.08,15.24
Holes 3.3 mm at 7.62,8.89 7.62,3.17 129.54,3.17 129.54,8.89

### Footprints (pad centres in the part's own frame; a part is rotated, then mirrored left to right if it is on the bottom)
C0402 = smd 0.55 x 0.6: 1 -0.525,0; 2 0.525,0
C0603 = smd 1.1 x 1: 1 -0.8,0; 2 0.8,0
SOT23 = smd 1 x 1.4: 1 -0.95,-1.1; 2 0.95,-1.1; 3 0,1.1
SOD123 = smd 0.914 x 1.219: A 1.638,0; C -1.638,0
LEDSC160X160X070-4N = smd 0.89 x 0.64: 1 -0.87,0.425; 2 0.87,0.425; 3 0.87,-0.425; 4 -0.87,-0.425
D0603 = smd 1.1 x 1: A 0.8,0; C -0.8,0
USB_MICRO_A_RA = smd 0.4 x 1.5: 1 -1.3,-0.25; 2 -0.65,-0.25; 3 0,-0.25; 4 0.65,-0.25; 5 1.3,-0.25 | smd 1.6 x 1.4: S1 -3.4,-0.427; S6 3.4,-0.427 | drill 0.508 pad 1.016 long: S2 -3.3,-2.675; S5 3.3,-2.675 | smd 1.9 x 1.9: S3 -1.2,-2.675; S4 1.2,-2.675
3WAY_LED_WIRES = drill 1.4 pad 3.81 square: 1 3.175,3.175; 2 -3.175,0; 3 3.175,-3.175
1X10 = drill 1.016 pad 1.778 square: 1 -11.43,0 | drill 1.016 pad 1.778: 2 -8.89,0; 3 -6.35,0; 4 -3.81,0; 5 -1.27,0; 6 1.27,0; 7 3.81,0; 8 6.35,0; 9 8.89,0; 10 11.43,0
WIZNET_RB1-125BAG1A = drill 0.9 pad 1.778: L1 6.325,-3.38; L2 3.784,-4.899; L3 -3.786,-3.379; L4 -6.325,-4.9; R2 -3.176,8.889; R3 -1.906,6.349; R4 -0.636,8.889; R5 0.634,6.349; R6 1.904,8.889; R7 3.174,6.349; R8 4.444,8.889 | drill 0.9 pad 1.7: R1 -4.446,6.349 | drill 1.6 pad 2.54: S1 -7.876,3.049; S2 7.874,3.049 | hole 3.3: 5.714,-0.001; -5.716,-0.001
1X02 = drill 1.016 pad 1.778 square: 1 -1.27,0 | drill 1.016 pad 1.778: 2 1.27,0
NRG4026 = smd 1.2 x 3.7: 1 -1.4,0; 2 1.4,0
L0603 = smd 1.1 x 1: 1 -0.8,0; 2 0.8,0
R0402 = smd 0.55 x 0.6: 1 -0.525,0; 2 0.525,0
R0603 = smd 1.1 x 1: 1 -0.8,0; 2 0.8,0
SM6MM = smd 2.1 x 1.4: 1 -4.55,2.3; 2 4.55,2.3; 3 -4.55,-2.3; 4 4.55,-2.3
SOP65P640X120-14N = smd 1.473 x 0.356: 1 -2.921,1.956; 2 -2.921,1.295; 3 -2.921,0.66; 4 -2.921,0; 5 -2.921,-0.66; 6 -2.921,-1.295; 7 -2.921,-1.956; 8 2.921,-1.956; 9 2.921,-1.295; 10 2.921,-0.66; 11 2.921,0; 12 2.921,0.66; 13 2.921,1.295; 14 2.921,1.956
MODULE_ESP32WROOM32D = smd 2 x 0.9: 1 -8.5,5.26; 2 -8.5,3.99; 3 -8.5,2.72; 4 -8.5,1.45; 5 -8.5,0.18; 6 -8.5,-1.09; 7 -8.5,-2.36; 8 -8.5,-3.63; 9 -8.5,-4.9; 10 -8.5,-6.17; 11 -8.5,-7.44; 12 -8.5,-8.71; 13 -8.5,-9.98; 14 -8.5,-11.25; 25 8.5,-11.25; 26 8.5,-9.98; 27 8.5,-8.71; 28 8.5,-7.44; 29 8.5,-6.17; 30 8.5,-4.9; 31 8.5,-3.63; 32 8.5,-2.36; 33 8.5,-1.09; 34 8.5,0.18; 35 8.5,1.45; 36 8.5,2.72; 37 8.5,3.99; 38 8.5,5.26 | smd 0.9 x 2: 15 -5.715,-12.25; 16 -4.445,-12.25; 17 -3.175,-12.25; 18 -1.905,-12.25; 19 -0.635,-12.25; 20 0.635,-12.25; 21 1.905,-12.25; 22 3.175,-12.25; 23 4.445,-12.25; 24 5.715,-12.25 | smd 5 x 5: 39 -1,-2.24
QFN50P500X500X80_29N = smd 1.01 x 0.27: 1 -2.36,1.5; 2 -2.36,1; 3 -2.36,0.5; 4 -2.36,0; 5 -2.36,-0.5; 6 -2.36,-1; 7 -2.36,-1.5; 15 2.36,-1.5; 16 2.36,-1; 17 2.36,-0.5; 18 2.36,0; 19 2.36,0.5; 20 2.36,1; 21 2.36,1.5 | smd 0.27 x 1.01: 8 -1.5,-2.36; 9 -1,-2.36; 10 -0.5,-2.36; 11 0,-2.36; 12 0.5,-2.36; 13 1,-2.36; 14 1.5,-2.36; 22 1.5,2.36; 23 1,2.36; 24 0.5,2.36; 25 0,2.36; 26 -0.5,2.36; 27 -1,2.36; 28 -1.5,2.36 | smd 3.25 x 3.25: 29 0,0
SOT23_6 = smd 0.69 x 1: 1 -0.95,-1.3; 2 0,-1.3; 3 0.95,-1.3; 4 0.95,1.3; 5 0,1.3; 6 -0.95,1.3
QFN50P400X400X100-25N = smd 0.86 x 0.26: 1 -1.935,1.25; 2 -1.935,0.75; 3 -1.935,0.25; 4 -1.935,-0.25; 5 -1.935,-0.75; 6 -1.935,-1.25; 13 1.935,-1.25; 14 1.935,-0.75; 15 1.935,-0.25; 16 1.935,0.25; 17 1.935,0.75; 18 1.935,1.25 | smd 0.26 x 0.86: 7 -1.25,-1.935; 8 -0.75,-1.935; 9 -0.25,-1.935; 10 0.25,-1.935; 11 0.75,-1.935; 12 1.25,-1.935; 19 1.25,1.935; 20 0.75,1.935; 21 0.25,1.935; 22 -0.25,1.935; 23 -0.75,1.935; 24 -1.25,1.935 | smd 2.5 x 2.5: 25 0,0

### Placement (x,y rotation side)
C1  86.87,5.59 0 top
C2  99.31,27.94 90 top
C3  18.03,34.8 90 top
C4  102.11,29.46 90 top
C5  103.38,29.72 90 top
C6  26.42,30.23 270 top
C7  27.69,30.23 270 top
C8  105.16,9.14 270 top
C9  29.72,30.23 270 top
C10  30.99,30.23 270 top
C11  57.66,7.11 90 top
C12  55.12,6.35 0 top
C13  86.36,16 90 top
C14  55.37,11.68 0 top
C15  62.99,10.41 270 top
C16  69.09,8.38 270 top
C17  69.34,16 270 top
C18  35.56,5.84 270 top
C19  101.6,5.84 270 top
C20  49.78,25.4 90 top
C21  54.1,18.03 0 top
C22  52.07,13.46 180 top
C23  44.45,25.91 180 top
C24  51.31,15.24 270 top
C25  52.58,15.24 270 top
C26  44.45,22.86 0 top
C27  46.23,21.34 90 top
C28  47.24,15.24 270 top
C29  34.8,18.8 270 top
D1  51.05,6.1 270 top
D2  65.28,5.84 0 top
D3  73.15,13.97 180 top
D4  125.98,16.76 270 top
D5  69.74,29.95 295 top
D6  76.57,29.92 245 top
J1  16.51,32.51 270 top
J2  93.98,5.84 180 bottom
J3  43.18,5.84 180 top
J4  68.58,2.03 180 top
J5  22.86,19.3 270 top
J7  72.39,7.62 180 top
L1  65.79,9.4 0 top
L2  44.45,24.38 180 top
Q1  45.21,33.02 270 top
Q2  49.28,29.97 270 top
R1  100.58,27.94 90 top
R2  76.2,8.89 0 top
R3  40.64,30.23 270 top
R4  50.29,10.41 180 top
R5  103.38,17.02 90 top
R6  39.37,30.23 90 top
R7  46.23,30.23 90 top
R8  44.2,30.23 270 top
R9  121.16,10.41 90 top
R10  119.89,10.41 90 top
R11  97.03,12.7 270 top
R12  97.28,25.4 180 top
R13  103.12,9.14 270 top
R14  104.14,9.14 90 top
R15  59.94,6.35 180 top
R16  87.63,16 270 top
R17  74.42,16 180 top
R18  71.88,16 0 top
R19  70.61,13.97 270 top
R20  61.72,11.68 0 top
R21  59.18,11.68 0 top
R22  67.82,16 270 top
R23  125.98,19.3 0 top
R24  125.98,14.22 0 top
R25  125.98,12.95 0 top
R26  51.05,25.4 270 top
R27  48.51,25.4 90 top
R28  45.97,17.27 90 top
R29  56.13,17.02 180 top
R30  54.36,14.99 270 top
R31  53.34,21.59 0 top
R32  54.61,19.05 180 top
R33  53.34,22.86 0 top
R34  56.64,18.54 90 top
R35  56.13,15.49 0 top
R36  53.34,20.32 0 top
R37  42.67,18.54 180 top
R38  43.43,17.53 180 top
R39  43.43,21.08 180 top
R40  43.43,13.97 180 top
R41  43.43,12.7 180 top
R42  42.67,20.07 180 top
R43  59.69,4.83 0 top
R44  72.39,5.59 0 top
R45  85.6,24.89 0 top
R46  85.6,26.16 0 top
S1  82.04,16 0 top
S2  63.5,16 0 top
S3  91.44,25.15 90 top
U1  81.53,7.62 180 top
U2  113.79,25.15 0 top
U3  35.56,32.51 0 top
U4  55.37,9.14 270 top
U5  60.45,8.89 180 top
U6  49.53,19.3 90 top
U$8  [BAAAHS_LOGO]  60.71,16.51 0 top
U$9  [BAAAHS_FABRICATION_TITLEBLOCK]  -101.09,-87.12 0 top  (outside the outline)
U$10  [STACKUP_4LAYER_1.6MM]  63.5,-33.02 0 top  (outside the outline)
U$11  [NOTE_HASL_BLACK_NARROW]  -93.98,-48.26 0 top  (outside the outline)
U$12  [FIDUCIAL_1MM]  43.94,36.32 0 top
U$13  [FIDUCIAL_1MM]  125.73,9.65 0 top
U$14  [FIDUCIAL_1MM]  13.72,1.78 0 top
U$16  [BAAAHS_TOP_ASSEMBLY_TITLEBLOCK]  -101.09,-87.12 0 top  (outside the outline)

### Tracks (layer width: path | path; a pad name or v marks a point on that pad's centre or on a via)
3V3  (via drill 0.3, 0.35)
  Top 0.203: U3.6 28.45,31.51 C7.1 C6.1 25.42,30.75 v25.15,30.48 | U3.7 32.03,31.01 31.77,30.75 C10.1 C9.1 28.97,30.75 v28.7,30.48 | R3.1 v40.64,31.75 | U1.1 86.27,5.66 C1.1 86.34,5.06 86.11,4.83 v85.6,4.83 | R27.2 48.24,25.65 v46.99,25.65 | R33.2 53.87,22.1 | R31.2 53.87,22.1 | 53.87,22.1 54.86,22.1 v54.82,22.14 | R29.2 v54.1,17.02 54.1,17.51 C21.1 52.56,19.05 U6.9 | C13.1 85.07,15.48 v84.84,15.24 86.37,13.7 S1.4 | D5.A 70.11,29.19 D6.A 79.52,29.19 83.16,25.56 87.22,25.56 v87.63,25.15 | S1.3 75.42,13.7 75.31,13.59 | D3.1 75.27,13.54 75.31,13.59 | R2.1 74.93,8.89 J7.1 | R22.2 67.8,15.49 v66.8,15.49 | R30.2 v54.36,13.46 | R10.1 R9.1 121.17,9.91 v122.17,9.91 | v100.58,29.46 R1.2 102.11,28.46 C4.1 102.87,28.66 102.87,28.68 C5.1 103.38,29.14 U2.2 | v124.61,16 124.63,16.02 124.63,16.35 125.07,16.8 126.05,16.8 126.41,17.15 D4.1 | 75.31,13.59 75.31,12.83 v75.44,12.7
  Top 0.406: J7.1 73.19,7.15 R44.2 | L2.1 C23.1 46.74,25.91 v46.99,25.65
  Route2 0.203: 40.64,31.58 v40.64,31.75
  Bottom 0.203: v87.63,25.15 116.01,25.15 117.86,26.99 v117.86,28.96 | v117.86,28.96 117.35,29.46 v100.58,29.46 | v25.15,30.48 v28.7,30.48 30.48,30.48 32,28.96 37.85,28.96 v40.64,31.75 46.74,25.65 v46.99,25.65 46.99,23.88 49.53,21.34 53.25,21.34 54.06,22.14 v54.82,22.14 54.82,21.38 54.1,20.66 v54.1,17.02 49.78,17.02 49.28,16.51 49.28,15.49 51.31,13.46 v54.36,13.46 56.38,15.49 v66.8,15.49 69.59,12.7 v75.44,12.7 82.3,12.7 v84.84,15.24 86.94,13.13 107.52,13.13 110.74,9.91 v122.17,9.91 124.61,12.34 v124.61,16 122.94,17.68 122.94,27.94 121.95,28.93 117.89,28.93 v117.86,28.96 | J4.1 80.01,4.83 | v85.6,4.83 80.01,4.83 | J7.1 76.71,7.62 79.5,4.83 80.01,4.83
  pour Bottom: -1.27,39.88 57.66,39.88 57.66,30.73 140.21,30.73 140.21,-2.54 -1.27,-2.54
5V0
  Top 0.406: J4.10 54.36,2.03 52.15,4.23 D1.3 52.15,7.11 51.65,7.62 51.65,8.97 52.83,10.16 54.21,10.16 U4.1 54.27,11.11 C14.1 54.85,11.94 55.3,12.39 68.13,12.39 70.1,10.41 79.26,10.41 79.76,9.92 79.76,5.98 79.44,5.66 U1.14
5VIO_0B
  Top 0.203: J2.2 89.03,4.06 75.26,4.06 | J4.6 68.63,3.35 74.55,3.35 75.26,4.06 | U1.13 77.52,6.33 75.26,4.06
5VIO_1B
  Top 0.203: J3.2 46.35,3.17 48.77,0.76 63.5,0.76 J4.7 66.5,3.76 74.37,3.76 77.57,6.96 U1.12
5VIO_2B
  Top 0.203: J4.8 64.36,4.17 74.12,4.17 77.57,7.62 U1.11
5VIO_3B
  Top 0.203: U1.10 77.62,8.28 73.91,4.57 62.23,4.57 J4.9
!RESET  (via drill 0.35)
  Top 0.203: U2.3 103.47,27.86 103.02,27.41 C2.1 | R1.1 C2.1 | Q2.3 51.31,29.97 51.56,29.72 v51.56,27.94 | 42.67,30.75 42.93,30.5 42.93,29.23 44.47,27.69 51.31,27.69 v51.56,27.94 | C2.1 89.14,27.41 S3.2 S3.1 62.97,20.6 v55.63,27.94 | R26.1 51.05,26.67 51.56,27.18 v51.56,27.94
  Bottom 0.203: v55.63,27.94 v51.56,27.94
FB
  Top 0.203: U5.3 59.71,10.39 R21.2 R20.1
GND  (via drill 0.3, 0.35)
  Top 0.203: v31.75,33.53 32.27,33.01 U3.3 35.06,33.01 U3.29 | J1.S6 13.94,29.11 J1.S5 J1.S4 | J1.S3 J1.S2 15.98,35.81 J1.S1 | v18.03,36.58 C3.2 | R6.2 v39.37,31.75 | C12.2 55.92,7.4 v56.13,7.62 | v56.13,7.62 56.47,7.96 U4.3 56.47,10.35 55.9,10.92 C14.2 R21.1 | v56.13,7.62 56.43,7.91 C11.2 58.42,7.91 59.18,8.67 60.07,8.67 60.45,9.05 U5.2 60.45,9.9 | C28.2 46.24,14.71 v46.23,14.73 | R28.1 45.99,16.76 v46.99,16.76 | C22.2 v50.04,13.46 50.04,14.48 50.27,14.71 C24.2 C25.2 | C21.2 v55.63,18.03 55.63,19.05 R32.1 | U2.38 120.72,30.41 v120.65,30.48 | v105.16,7.62 C8.2 R14.1 | C1.2 87.38,5.61 v87.38,6.6 | v83.06,8.38 83.06,9.2 83.44,9.58 U1.7 | R16.2 88.12,14.99 v88.65,14.99 | S3.3 93.74,23.89 v93.98,24.13 | v96.01,12.19 97.01,12.19 R11.2 | U2.15 108.08,10.79 v108.2,10.67 | U2.39 112.79,19.83 v112.78,19.81 | 68.07,13.97 68.33,14.22 | v68.07,5.84 69.09,6.86 C16.2 | S2.3 65.26,13.7 v65.79,14.22 66.31,13.7 S2.4 68.41,13.7 69.34,14.64 C17.2 | S3.4 93.76,29.72 v95.25,29.72 | R12.2 96.01,24.66 v96.01,24.13 | v107.19,30.23 107.01,30.41 U2.1 105.29,30.24 C5.2 102.11,30.24 C4.2 100.11,30.26 v99.31,29.46 C2.2 | J3.1 36.45,2.67 35.56,3.56 C18.2 | v34.8,17.27 C29.2 | C20.2 v49.78,26.92 | v86.11,27.43 86.12,27.41 R46.2 | R45.2 86.12,24.38 86.39,24.12 v86.86,24.12
  Top 0.406: D2.A v68.07,5.84 | C6.2 26.42,29.19 26.91,28.7 v27.69,28.7 C7.2 | C9.2 v29.72,28.7 30.5,28.7 30.99,29.19 C10.2 | C26.2 v46.48,22.86 46.48,22.11 C27.2 | C23.2 v42.42,25.91 | C19.2 101.6,3.77 100.5,2.67 J2.1 | J1.S4 J1.S3 | J1.5 17.56,31.21 v17.78,30.99
  Route15 0.203: 17.96,27.18 J5.S1 27.69,27.18 | 17.96,27.18 17.78,27.18 | v31.75,33.53 31.75,27.18 | 31.75,27.18 29.72,27.18 | v18.03,36.58 17.26,35.81 J1.S2 13.97,35.68 13.97,27.18 | v39.37,31.75 39.37,27.18 | 39.37,27.18 31.75,27.18 | 29.72,27.18 27.69,27.18 | v56.13,7.62 59.44,7.62 61.21,5.84 65.79,5.84 | 65.79,5.84 v68.07,5.84 69.85,5.84 J4.5 J4.4 72.39,0.76 | v46.48,22.86 39.37,22.86 | 39.37,22.86 34.8,22.86 v34.8,17.27 34.8,14.73 v46.23,14.73 | v42.42,25.91 42.42,26.92 | v46.23,14.73 46.23,16 v46.99,16.76 48.26,18.03 48.77,18.03 | v50.04,13.46 48.77,14.73 v46.23,14.73 | v55.63,18.03 48.77,18.03 | 105.16,0.76 125.73,0.76 125.73,19.05 124.71,19.05 | 105.16,0.76 v105.16,7.62 v108.2,10.67 106.68,12.19 v96.01,12.19 93.98,14.22 v93.98,24.13 v96.01,24.13 96.01,27.43 95.25,27.43 | v120.65,30.48 124.7,30.48 124.71,30.47 124.71,19.05 | 124.71,19.05 113.54,19.05 v112.78,19.81 | J2.1 97.16,0.76 | 105.16,0.76 97.16,0.76 | 87.38,0.76 v87.38,6.6 88.65,7.87 v88.65,14.99 | 97.16,0.76 87.38,0.76 | 83.06,0.76 72.39,0.76 | v83.06,8.38 83.06,0.76 | 83.06,0.76 87.38,0.76 | v65.79,14.22 65.79,5.84 | 72.39,0.76 40.01,0.76 | 40.01,0.76 25.91,0.76 | 25.91,0.76 13.97,0.76 13.97,27.18 | 13.97,27.18 17.78,27.18 | J5.L4 17.96,27.18 | J3.1 40.01,0.76 | J5.S2 25.91,0.76 | 95.25,27.43 v95.25,28.19 v95.25,29.72 95.76,30.23 v107.19,30.23 | 88.39,27.43 v86.11,27.43 | 88.39,27.43 95.25,27.43 | v49.78,26.92 42.42,26.92 | 17.78,27.18 v17.78,30.99 | v29.72,28.7 29.72,27.18 | 39.37,27.18 39.37,26.92 | 39.37,26.92 42.42,26.92 | 39.37,26.92 39.37,22.86 | 48.77,18.03 v48.77,18.54 49.53,18.54 | 49.53,18.54 v50.29,18.54 v50.29,20.07 v48.77,20.07 | U6.25 49.53,18.54 | v27.69,28.7 27.69,27.18
  Route15 0.203: v86.86,24.12 86.97,24.23 88.16,24.23 88.39,24.47 88.39,27.43
  other vias: 49.53,19.3 69.09,6.35 70.1,5.84 69.09,5.33 32.77,35.31 34.29,37.08
  pour Route15: -1.27,39.88 57.66,39.88 57.66,30.73 140.21,30.73 140.21,-2.54 -1.27,-2.54
  pour Route2: -1.27,39.88 57.66,39.88 57.66,30.73 140.21,30.73 140.21,-2.54 -1.27,-2.54
  pour Top (rank 2, no thermals): -1.27,39.88 57.66,39.88 57.66,30.73 140.21,30.73 140.21,-2.54 99.82,-2.54 99.82,6.6 92.96,6.6 92.96,-2.54 43.69,-2.54 43.69,11.94 28.19,11.94 28.19,28.96 22.86,28.96 22.86,27.94 -1.27,27.94
  pour Top: -2.54,28.96 43.69,28.96 43.69,-2.54 -2.54,-2.54
  pour Top: 92.96,6.6 99.82,6.6 99.82,-2.54 92.96,-2.54
HOST_RMII_CLK50  (via drill 0.35)
  Top 0.203: U6.5 v50.28,16.29 | v102.36,17.53 102.38,17.54 R5.2
  Bottom 0.203: v102.36,17.53 100.28,19.61 60.86,19.61 57.54,16.29 v50.28,16.29
HOST_RMII_CRS_DV  (via drill 0.35)
  Top 0.203: U2.12 107.88,16.44 v108.2,16.76 | v55.37,20.32 R36.2
  Bottom 0.203: v108.2,16.76 107.24,16.76 103.48,20.52 59.64,20.52 58.62,19.51 56.19,19.51 v55.37,20.32
HOST_RMII_MDC  (via drill 0.35)
  Top 0.203: U2.37 120.58,29.14 v119.38,27.94 | U6.13 50.78,22.08 51.82,23.11 v51.82,23.95
  Bottom 0.203: v119.38,27.94 114.81,23.37 57.35,23.37 56.26,24.46 52.32,24.46 v51.82,23.95
HOST_RMII_MDIO  (via drill 0.35)
  Top 0.203: U2.30 120.72,20.25 v120.65,20.32 | U6.12 51.47,21.75 52.57,22.86 R33.1 52.81,23.11 53.17,23.46 54.52,23.46 56.39,21.6 v56.39,21.16
  Bottom 0.203: v56.39,21.16 56.42,21.16 57,21.74 118.72,21.74 120.14,20.32 v120.65,20.32
HOST_RMII_RXD0  (via drill 0.35)
  Top 0.203: U2.10 107.37,18.98 v107.44,19.05 | v56.63,20.2 56.64,20.19 R34.2
  Bottom 0.203: v107.44,19.05 106.17,19.05 103.89,21.34 57.66,21.34 56.63,20.31 v56.63,20.2
HOST_RMII_RXD1  (via drill 0.35)
  Top 0.203: U2.11 107.37,17.71 v107.44,17.78 | v58.17,20.32 57.4,19.56 57.4,16.24 R35.2
  Bottom 0.203: v107.44,17.78 106.83,17.78 103.68,20.93 58.78,20.93 v58.17,20.32
HOST_RMII_TX_EN  (via drill 0.35)
  Top 0.203: U2.33 120.72,24.06 v120.65,24.13 | U6.16 49.28,22.41 v49.98,23.11
  Bottom 0.203: v120.65,24.13 119.08,22.55 56.95,22.55 55.88,23.62 53.29,23.62 52.02,22.35 50.74,22.35 v49.98,23.11
HOST_RMII_TXD0  (via drill 0.35)
  Top 0.203: U2.31 120.98,21.52 v120.65,21.84 | U6.17 48.78,22.87 v49.02,23.11 v49.02,23.12
  Bottom 0.203: v49.02,23.12 49.02,23.07 50.24,21.84 52.22,21.84 53.42,23.04 55.85,23.04 56.74,22.15 118.89,22.15 119.19,21.84 v120.65,21.84
HOST_RMII_TXD1  (via drill 0.35)
  Top 0.203: U2.36 120.72,27.87 v120.65,27.94 | U6.18 48.26,21.26 v48.26,23.88
  Bottom 0.203: v120.65,27.94 115.67,22.96 57.15,22.96 56.08,24.03 53.09,24.03 51.82,22.76 51.31,22.76 50.19,23.88 v48.26,23.88
IO0_BOOTMODE_SW0_UP  (via drill 0.35)
  Top 0.203: S2.2 68.05,18.41 69.71,20.07 86.89,20.07 90.58,16.39 v90.58,16.36 | S2.2 S2.1 58.95,23.35 49.28,33.02 Q1.3 | S2.2 67.82,18.07 R22.1 C17.1 | v122.22,12.19 122.29,12.27 U2.25
  Bottom 0.203: v122.22,12.19 122.22,15.2 119.89,17.53 113.28,17.53 111.33,15.57 93.14,15.57 92.35,16.36 v90.58,16.36
IO2_SW1_LOW  (via drill 0.35)
  Top 0.203: S1.1 86.36,18.3 | 86.36,18.3 S1.2 87.11,18.3 v88.9,16.51 | 86.36,18.3 C13.2 R16.1 | U2.24 119.51,14.27 119.04,14.73 v112.27,14.73
  Bottom 0.203: v88.9,16.51 89.74,15.67 92.23,15.67 92.91,14.99 112.01,14.99 v112.27,14.73
IO4_LED1G
  Top 0.203: U2.26 124.52,15.17 R24.1
IO5_5VIO_3A_UP  (via drill 0.35)
  Top 0.203: U1.5 86,8.28 90.68,12.95 v90.68,14.22 | U2.29 117.72,18.98 116.08,17.33 v116.08,16.76 116.09,16.76 116.96,15.9 119.29,15.9 120.8,14.4 120.8,11.28 121.14,10.94 R9.2
  Bottom 0.203: v116.08,16.76 116.08,16.31 113.31,13.54 91.41,13.54 90.73,14.22 v90.68,14.22
IO12_3V3IO_0_LOW
  Top 0.203: J4.2 78.66,3.23 93,3.23 94.01,4.23 94.01,11.71 95.52,13.22 R11.1 97.7,13.9 U2.14
IO13_LED1R
  Top 0.203: U2.16 109.35,9.78 110.24,8.89 122.43,8.89 125.48,11.94 125.48,12.94 R25.1
IO14_LED0B  (via drill 0.35)
  Top 0.203: U2.13 100.4,15.17 v98.3,17.27 | R17.1 v75.95,16
  Bottom 0.203: v98.3,17.27 97.28,18.29 78.23,18.29 v75.95,16
IO15_5VIO_2A_UP  (via drill 0.35)
  Top 0.203: U1.4 85.92,7.62 91.95,13.65 v91.95,14.48 | v114.3,15.49 119.13,15.49 120.39,14.23 120.39,11.43 119.91,10.94 R10.2 118.62,10.94 118.24,11.32 U2.23
  Bottom 0.203: v91.95,14.48 92.46,13.97 112.78,13.97 v114.3,15.49
IO16_LED1B
  Top 0.203: U2.27 123.88,16.44 124.46,17.02 124.46,18.8 124.97,19.3 R23.1
IO32_5VIO_0A
  Top 0.203: U1.2 85.89,6.33 101.08,21.51 102.45,21.51 102.46,21.52 U2.8
IO33_LED0G  (via drill 0.35)
  Top 0.203: U2.9 104.06,20.24 102.11,18.29 v99.57,18.29 | v71.12,17.02 71.36,16.78 R18.1
  Bottom 0.203: v71.12,17.02 75.95,17.02 77.72,18.8 99.06,18.8 v99.57,18.29
IO34_LED0R  (via drill 0.35)
  Top 0.203: U2.6 100.19,24.06 92.82,16.68 91.67,16.68 90.93,17.42 v90.93,17.53 | v70.41,15.8 70.61,15.6 R19.1
  Bottom 0.203: v90.93,17.53 78.74,17.53 76.45,15.24 70.98,15.24 v70.41,15.8
IO35_5VIO_1A
  Top 0.203: U1.3 85.95,6.96 101.77,22.78 102.49,22.78 102.5,22.79 U2.7
IO36_VSENSE
  Top 0.203: C8.1 R14.2 R13.1 105.93,9.67 107.07,10.8 107.07,14.02 108.97,15.92 108.97,24.3 106.67,26.59 105.3,26.59 U2.4
IO39_3V3IO_1_LOW  (via drill 0.35)
  Top 0.203: U2.5 105.28,25.32 97.89,25.32 R12.1 97.81,22.37 92.96,17.53 v92.46,17.53 | J4.3 76.53,3.63 92.84,3.63 93.6,4.4 93.6,12.83 v97.28,16.51
  Bottom 0.203: v97.28,16.51 96.27,17.53 v92.46,17.53
N$1  (via drill 0.35)
  Top 0.203: U2.28 120.98,17.71 v120.65,18.03 | R5.1 103.36,16.51 v102.36,16.51
  Bottom 0.203: v120.65,18.03 113.2,18.03 111.15,15.98 102.89,15.98 v102.36,16.51
N$2
  Top 0.203: J5.L3 19.48,19.73 16.51,16.76 16.51,12.95 20.07,9.4 27.69,9.4 29.72,11.43 36.59,11.43 37.86,12.7 R41.2
N$3
  Top 0.203: U5.4 59.42,7.51 R15.2
N$4
  Top 0.203: 62.62,7.59 62.62,6.86 D2.C | U5.6 62.62,7.59 | 62.62,7.59 62.99,7.59 62.99,9.4 | C15.2 62.99,9.4 | L1.1 62.99,9.4
  pour Top (no thermals): 60.96,8.13 60.96,5.08 65.53,5.08 65.53,11.43 63.5,11.43 63.5,10.41 62.23,10.41 62.23,8.13
N$5
  Top 0.203: U3.9 34.56,29.19 35.05,28.7 39.88,28.7 40.64,29.46 R3.2
N$6
  Top 0.203: U3.11 35.56,29.37 35.73,29.19 39.12,29.19 39.37,29.45 R6.1
N$7
  Top 0.203: R8.2 44.2,29.23 45.21,28.22 49,28.22 49.18,28.4 49.18,30.16 48.41,30.92 Q2.1
N$8
  Top 0.203: R7.2 46.23,31.22 45.31,32.14 45.31,33.54 44.87,33.97 Q1.1
N$9
  Top 0.203: D3.4 74.02,15.88 R17.2
N$10
  Top 0.203: D3.3 72.28,15.88 R18.2
N$11
  Top 0.203: D3.2 72.18,13.45 R19.2
N$14
  Top 0.203: D4.4 125.56,18.35 R23.2
N$15
  Top 0.203: R24.2 126.51,14.69 126.31,14.89 125.77,14.89 125.53,15.13 125.53,15.87 D4.3
N$16
  Top 0.203: R25.2 126.51,12.96 127.09,13.54 127.09,15.21 D4.2
N$18
  Top 0.203: U6.11 52.55,20.05 R36.1 R31.1
N$20
  Top 0.203: U6.7 51.79,18.05 52.25,17.59 52.25,17.33 54.07,15.51 R30.1 55.59,15.51 R35.1
N$21
  Top 0.203: U6.8 52.12,18.55 52.66,18.02 52.66,17.5 53.87,16.29 56.42,16.29 56.66,16.53 R29.1 56.64,17.04 R34.1
N$22
  Top 0.203: U6.24 46.83,18.05 46.63,17.85 46.03,17.85 R28.2
N$23
  Top 0.203: U6.3 49.28,14.99 46.99,12.7 R41.1
N$24
  Top 0.203: U6.2 48.78,15.11 47.64,13.97 R40.1
N$25
  Top 0.203: J5.L2 17.96,12.27 20.37,9.86 27.38,9.86 29.46,11.94 36.34,11.94 38.37,13.97 R40.2
N$26
  Top 0.203: C15.1 62.66,10.94 61.91,10.19 U5.1
N$27
  Top 0.203: U1.8 77.41,9.58 R2.2
N$28
  Top 0.203: U6.15 49.78,21.9 51.05,23.18 R26.2 | C20.1 R26.2 | R26.2 R27.1
N$29
  Top 0.203: U6.10 52.82,19.55 53.32,19.05 R32.2
N$30
  Top 0.406: U5.5 60.47,7.57 R15.1 60.49,6.35 R43.2
N$31
  Top 0.203: R20.2 67.86,11.68 69.09,10.45 C16.1
  Top 0.406: R44.1 71.59,7.15 J7.2 71.12,8.42 70.36,9.18 C16.1 67.4,9.18 L1.2
N$33
  Top 0.203: D6.C 79.08,30.64 83.57,26.16 R46.1
N$36
  Top 0.203: R45.1 72.9,24.89 68.83,28.96 68.83,30.23 69.28,30.67 D5.C
PHY_VDDCR
  Top 0.203: U6.6 50.78,16.86 51.31,16.33 C24.1 C25.1 53.09,15.77 53.38,15.47 53.38,13.97 C22.1
RD_N  (via drill 0.3)
  Top 0.229: U6.22 44.69,19.05 v44.31,18.68 44.17,18.54 R37.1
  Bottom 0.229: v44.31,18.68 39.35,13.72 32.89,13.72 J5.R8
RD_P  (via drill 0.3)
  Top 0.229: U6.23 45.48,18.55 v44.96,18.03 44.45,17.53 R38.1
  Bottom 0.229: v44.96,18.03 44.91,17.98 44.27,17.98 39.57,13.28 31.57,13.28 29.21,15.65 J5.R7
TD_N  (via drill 0.3)
  Top 0.229: U6.20 45.48,20.05 v44.96,20.57 44.45,21.08 R39.1
  Bottom 0.229: v44.96,20.57 44.91,20.62 44.27,20.62 43.13,21.77 32.46,21.77 J5.R2
TD_P  (via drill 0.3)
  Top 0.229: U6.21 44.69,19.55 v44.31,19.93 44.17,20.07 R42.1
  Bottom 0.229: v44.31,19.93 42.9,21.34 32.26,21.34 32.2,21.27 31.25,21.27 29.21,23.31 J5.R1
UART_DTR
  Top 0.203: U3.28 34.06,35.58 35.81,37.34 39.62,37.34 42.29,34.67 42.29,32.89 43.11,32.07 Q1.2 44.11,31.07 44.2,30.99 R8.1
UART_RTS  (via drill 0.35)
  Top 0.203: v40.19,33.53 37.9,35.81 36.32,35.81 36.07,35.56 36.06,35.55 U3.24 | R7.1 46.23,29.02 Q2.2 45.37,29.02 v45.2,29.19
  Bottom 0.203: v40.19,33.53 40.89,33.53 45.2,29.23 v45.2,29.19
UART_RXD  (via drill 0.35)
  Top 0.203: U2.34 116.91,25.33 v115.57,26.67 | v41.4,34.29 38.86,36.83 36,36.83 35.06,35.89 U3.26
  Bottom 0.203: v115.57,26.67 115.06,26.16 59.94,26.16 51.82,34.29 v41.4,34.29
UART_TXD  (via drill 0.35)
  Top 0.203: U2.35 117.68,26.6 v116.59,27.69 | U3.25 35.56,35.63 36.25,36.32 38.36,36.32 v39.62,35.06
  Bottom 0.203: v116.59,27.69 115.32,27.69 114.22,26.59 60.28,26.59 51.82,35.06 v39.62,35.06
USBD_N
  Top 0.279: J1.3 18.29,32.51 18.79,32.01 U3.5
USBD_P
  Top 0.279: U3.4 19.05,32.51 18.4,33.16 J1.2
VBUS  (via drill 0.35, 0.55)
  Top 0.203: U3.8 32.69,30.15 v32.51,29.97
  Top 0.406: J1.1 17.57,33.81 C3.1 18.05,34.29 v19.05,34.29 | R4.1 49.95,9.28 D1.1
  Top 0.813: R4.1 51.09,10.92 49.83,12.19 v49.06,12.19
  Bottom 0.813: v32.51,29.97 28.19,34.29 v19.05,34.29 17.41,34.29 16,32.88 16,11.14 18.29,8.85 27.22,8.85 30.52,12.15 49.06,12.15 v49.06,12.19
VDDA
  Top 0.203: U6.19 46.99,20.55 46.74,20.81 C27.1 45.79,20.81 43.74,22.86 C26.1 42.89,22.1 42.91,22.1 R39.2 | U6.1 48.28,16.8 C28.1 44.43,15.77 44.43,15.75 42.91,17.27 R38.2 | J5.L1 20.3,13.8 20.3,16.98 24.53,21.21 J5.R3 29.21,20.54 31,18.75 32.45,18.75 33.02,19.32 C29.1 34.81,19.3 42.15,19.3 | R42.2 42.15,19.3 | 42.15,19.3 R37.2
  Top 0.229: R38.2 42.42,17.53 42.15,17.8 R37.2 | R39.2 42.15,20.32 R42.2
  Top 0.406: L2.2 C26.1
VLED  (via drill 0.35)
  Top 0.406: R43.1 57.66,4.83 | 57.66,4.83 54.83,4.83 54.32,5.33 C12.1 54.32,8.15 U4.2 54.21,8.13 v52.83,8.13 | J3.3 36.7,9.02 35.56,7.87 C18.1 | J2.3 100.2,9.02 101.6,7.62 C19.1 101.64,6.6 102.62,6.6 103.12,7.11 R13.2 | 57.66,4.83 C11.1
  Top 0.813: R4.2 47.71,10.41 46.44,9.14 40.01,9.14 J3.3
  Bottom 0.406: v52.83,8.13 52.83,10.24
  Bottom 2.54: J2.3 95.94,10.24 52.83,10.24 41.22,10.24 J3.3

### Text on the board
tPlace: RESET | PWR | PWR | CH2 | CH1 | BAAAHS BRAIN | GND | GND | BAAAHS-BRN01-C
Fabrication: PLATED / SLOTS (x2)